# Altium project novena_pvt2.PrjPcb (part 1 of 4)
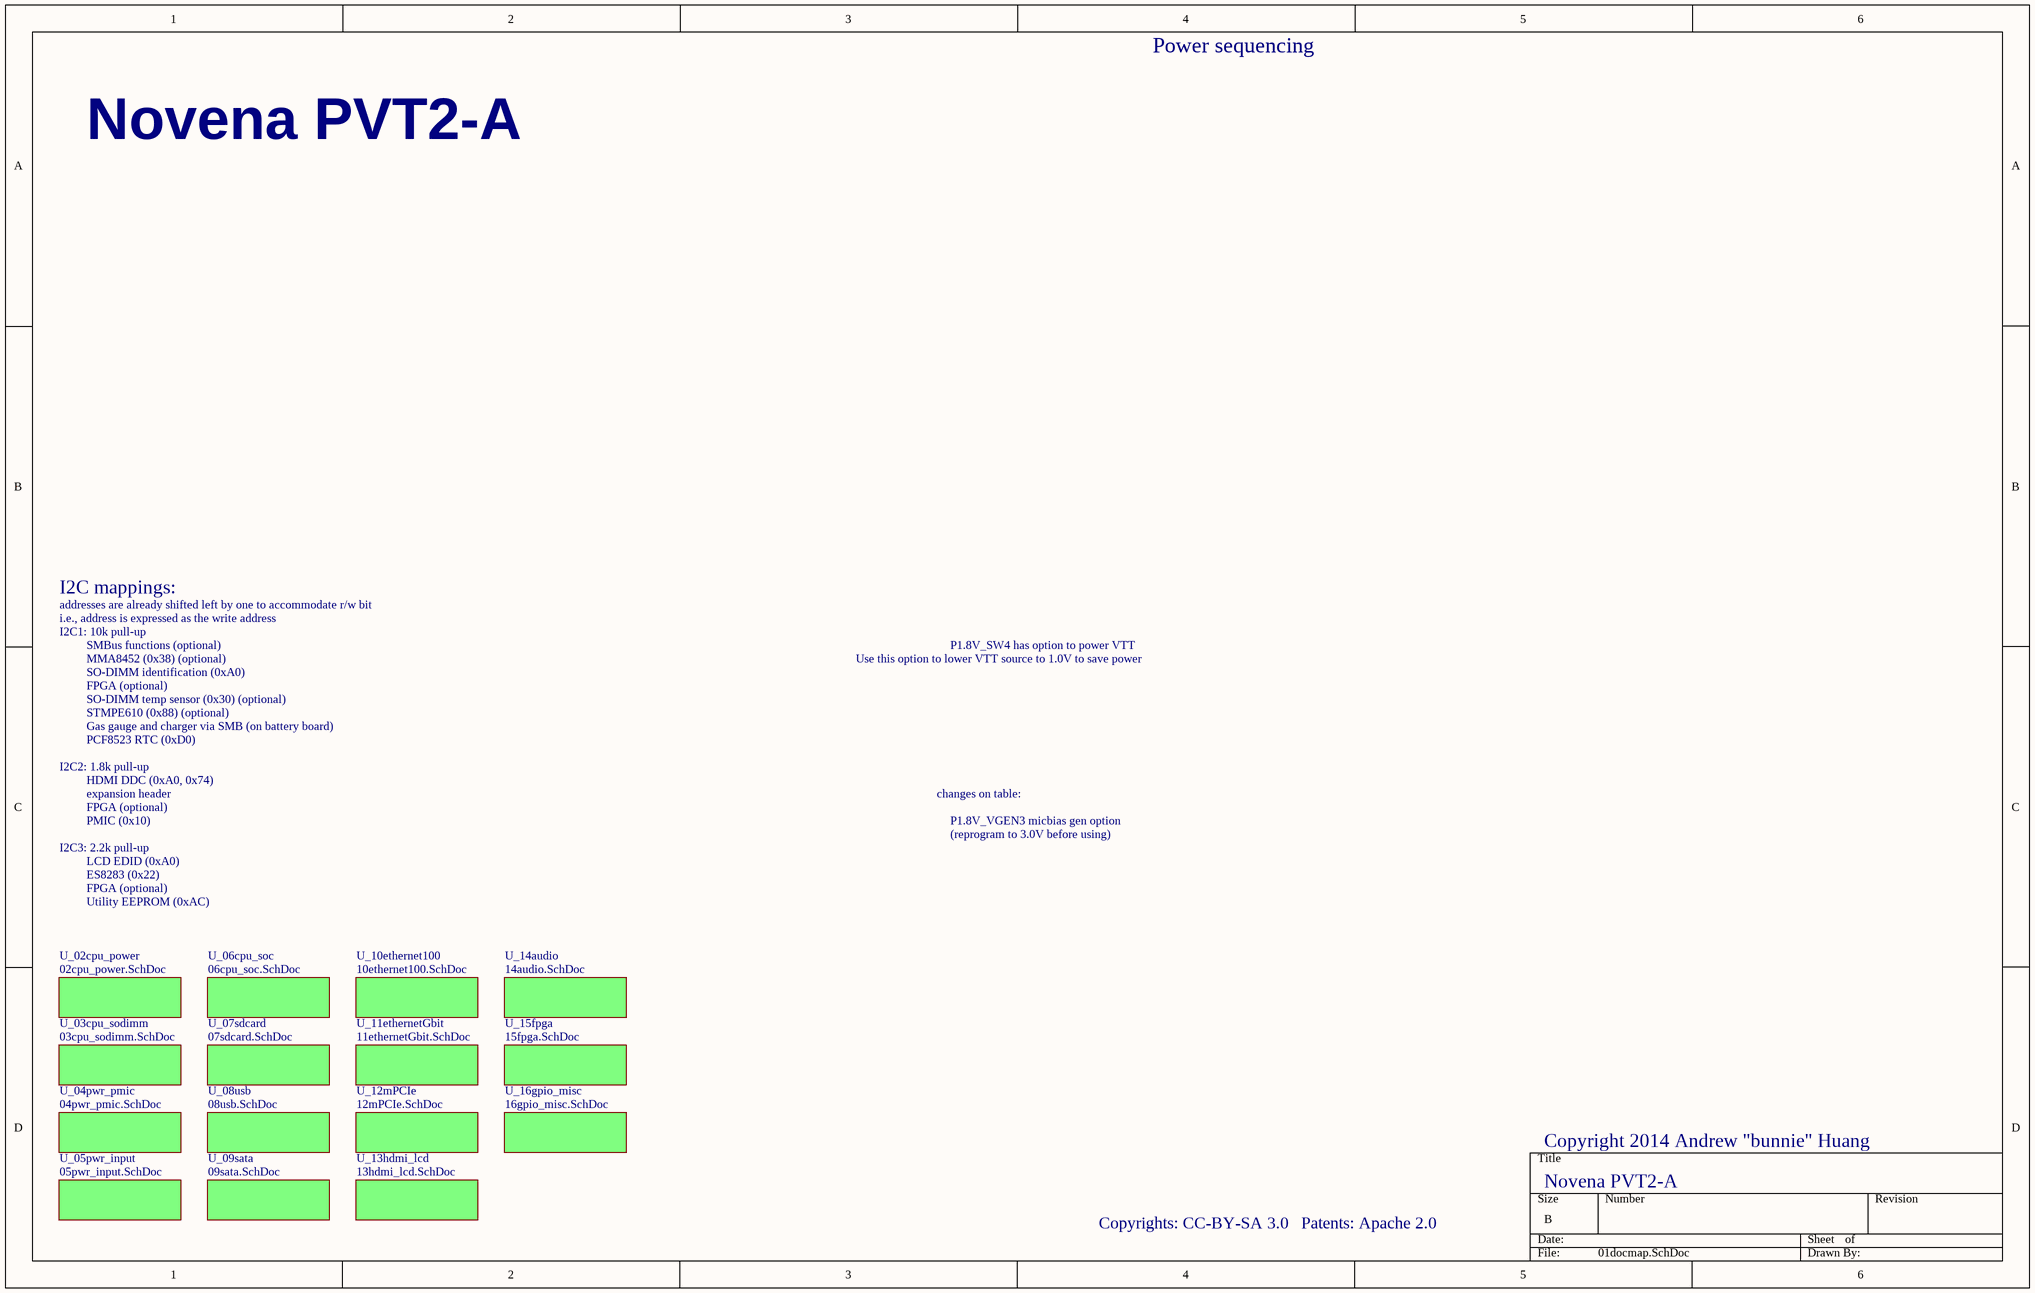
[diagram p0: 01docmap.SchDoc]
16 sheets, 975 parts. Net scope: global (net labels, ports and power ports of the same name join across sheets).
Board file: novena_pvt2_a.PcbDoc
Sheets:
  01docmap.SchDoc
    U_02cpu_power = 02cpu_power.SchDoc
    U_03cpu_sodimm = 03cpu_sodimm.SchDoc
    U_04pwr_pmic = 04pwr_pmic.SchDoc
    U_05pwr_input = 05pwr_input.SchDoc
    U_06cpu_soc = 06cpu_soc.SchDoc
    U_07sdcard = 07sdcard.SchDoc
    U_08usb = 08usb.SchDoc
    U_09sata = 09sata.SchDoc
    U_10ethernet100 = 10ethernet100.SchDoc
    U_11ethernetGbit = 11ethernetGbit.SchDoc
    U_12mPCIe = 12mPCIe.SchDoc
    U_13hdmi_lcd = 13hdmi_lcd.SchDoc
    U_14audio = 14audio.SchDoc
    U_15fpga = 15fpga.SchDoc
    U_16gpio_misc = 16gpio_misc.SchDoc

## Sheet 01docmap.SchDoc
size B

### Sub-sheets
U_02cpu_power = 02cpu_power.SchDoc: no entries
U_03cpu_sodimm = 03cpu_sodimm.SchDoc: no entries
U_04pwr_pmic = 04pwr_pmic.SchDoc: no entries
U_05pwr_input = 05pwr_input.SchDoc: no entries
U_06cpu_soc = 06cpu_soc.SchDoc: no entries
U_07sdcard = 07sdcard.SchDoc: no entries
U_08usb = 08usb.SchDoc: no entries
U_09sata = 09sata.SchDoc: no entries
U_10ethernet100 = 10ethernet100.SchDoc: no entries
U_11ethernetGbit = 11ethernetGbit.SchDoc: no entries
U_12mPCIe = 12mPCIe.SchDoc: no entries
U_13hdmi_lcd = 13hdmi_lcd.SchDoc: no entries
U_14audio = 14audio.SchDoc: no entries
U_15fpga = 15fpga.SchDoc: no entries
U_16gpio_misc = 16gpio_misc.SchDoc: no entries

### Notes on the sheet
- Power sequencing
- Novena PVT2-A
- I2C mappings:
- I2C1: 10k pull-up
- addresses are already shifted left by one to accommodate r/w bit
- i.e., address is expressed as the write address
- SMBus functions (optional)
- MMA8452 (0x38) (optional)
- SO-DIMM identification (0xA0)
- FPGA (optional)
- SO-DIMM temp sensor (0x30) (optional)
- Use this option to lower VTT source to 1.0V to save power
- P1.8V_SW4 has option to power VTT
- I2C2: 1.8k pull-up
- STMPE610 (0x88) (optional)
- Gas gauge and charger via SMB (on battery board)
- PCF8523 RTC (0xD0)
- HDMI DDC (0xA0, 0x74)
- expansion header
- PMIC (0x10)
- changes on table:
- P1.8V_VGEN3 micbias gen option
- (reprogram to 3.0V before using)
- I2C3: 2.2k pull-up
- LCD EDID (0xA0)
- ES8283 (0x22)
- Utility EEPROM (0xAC)
- Copyright 2014 Andrew "bunnie" Huang
- Copyrights: CC-BY-SA 3.0
- Patents: Apache 2.0

## Sheet 02cpu_power.SchDoc
size C
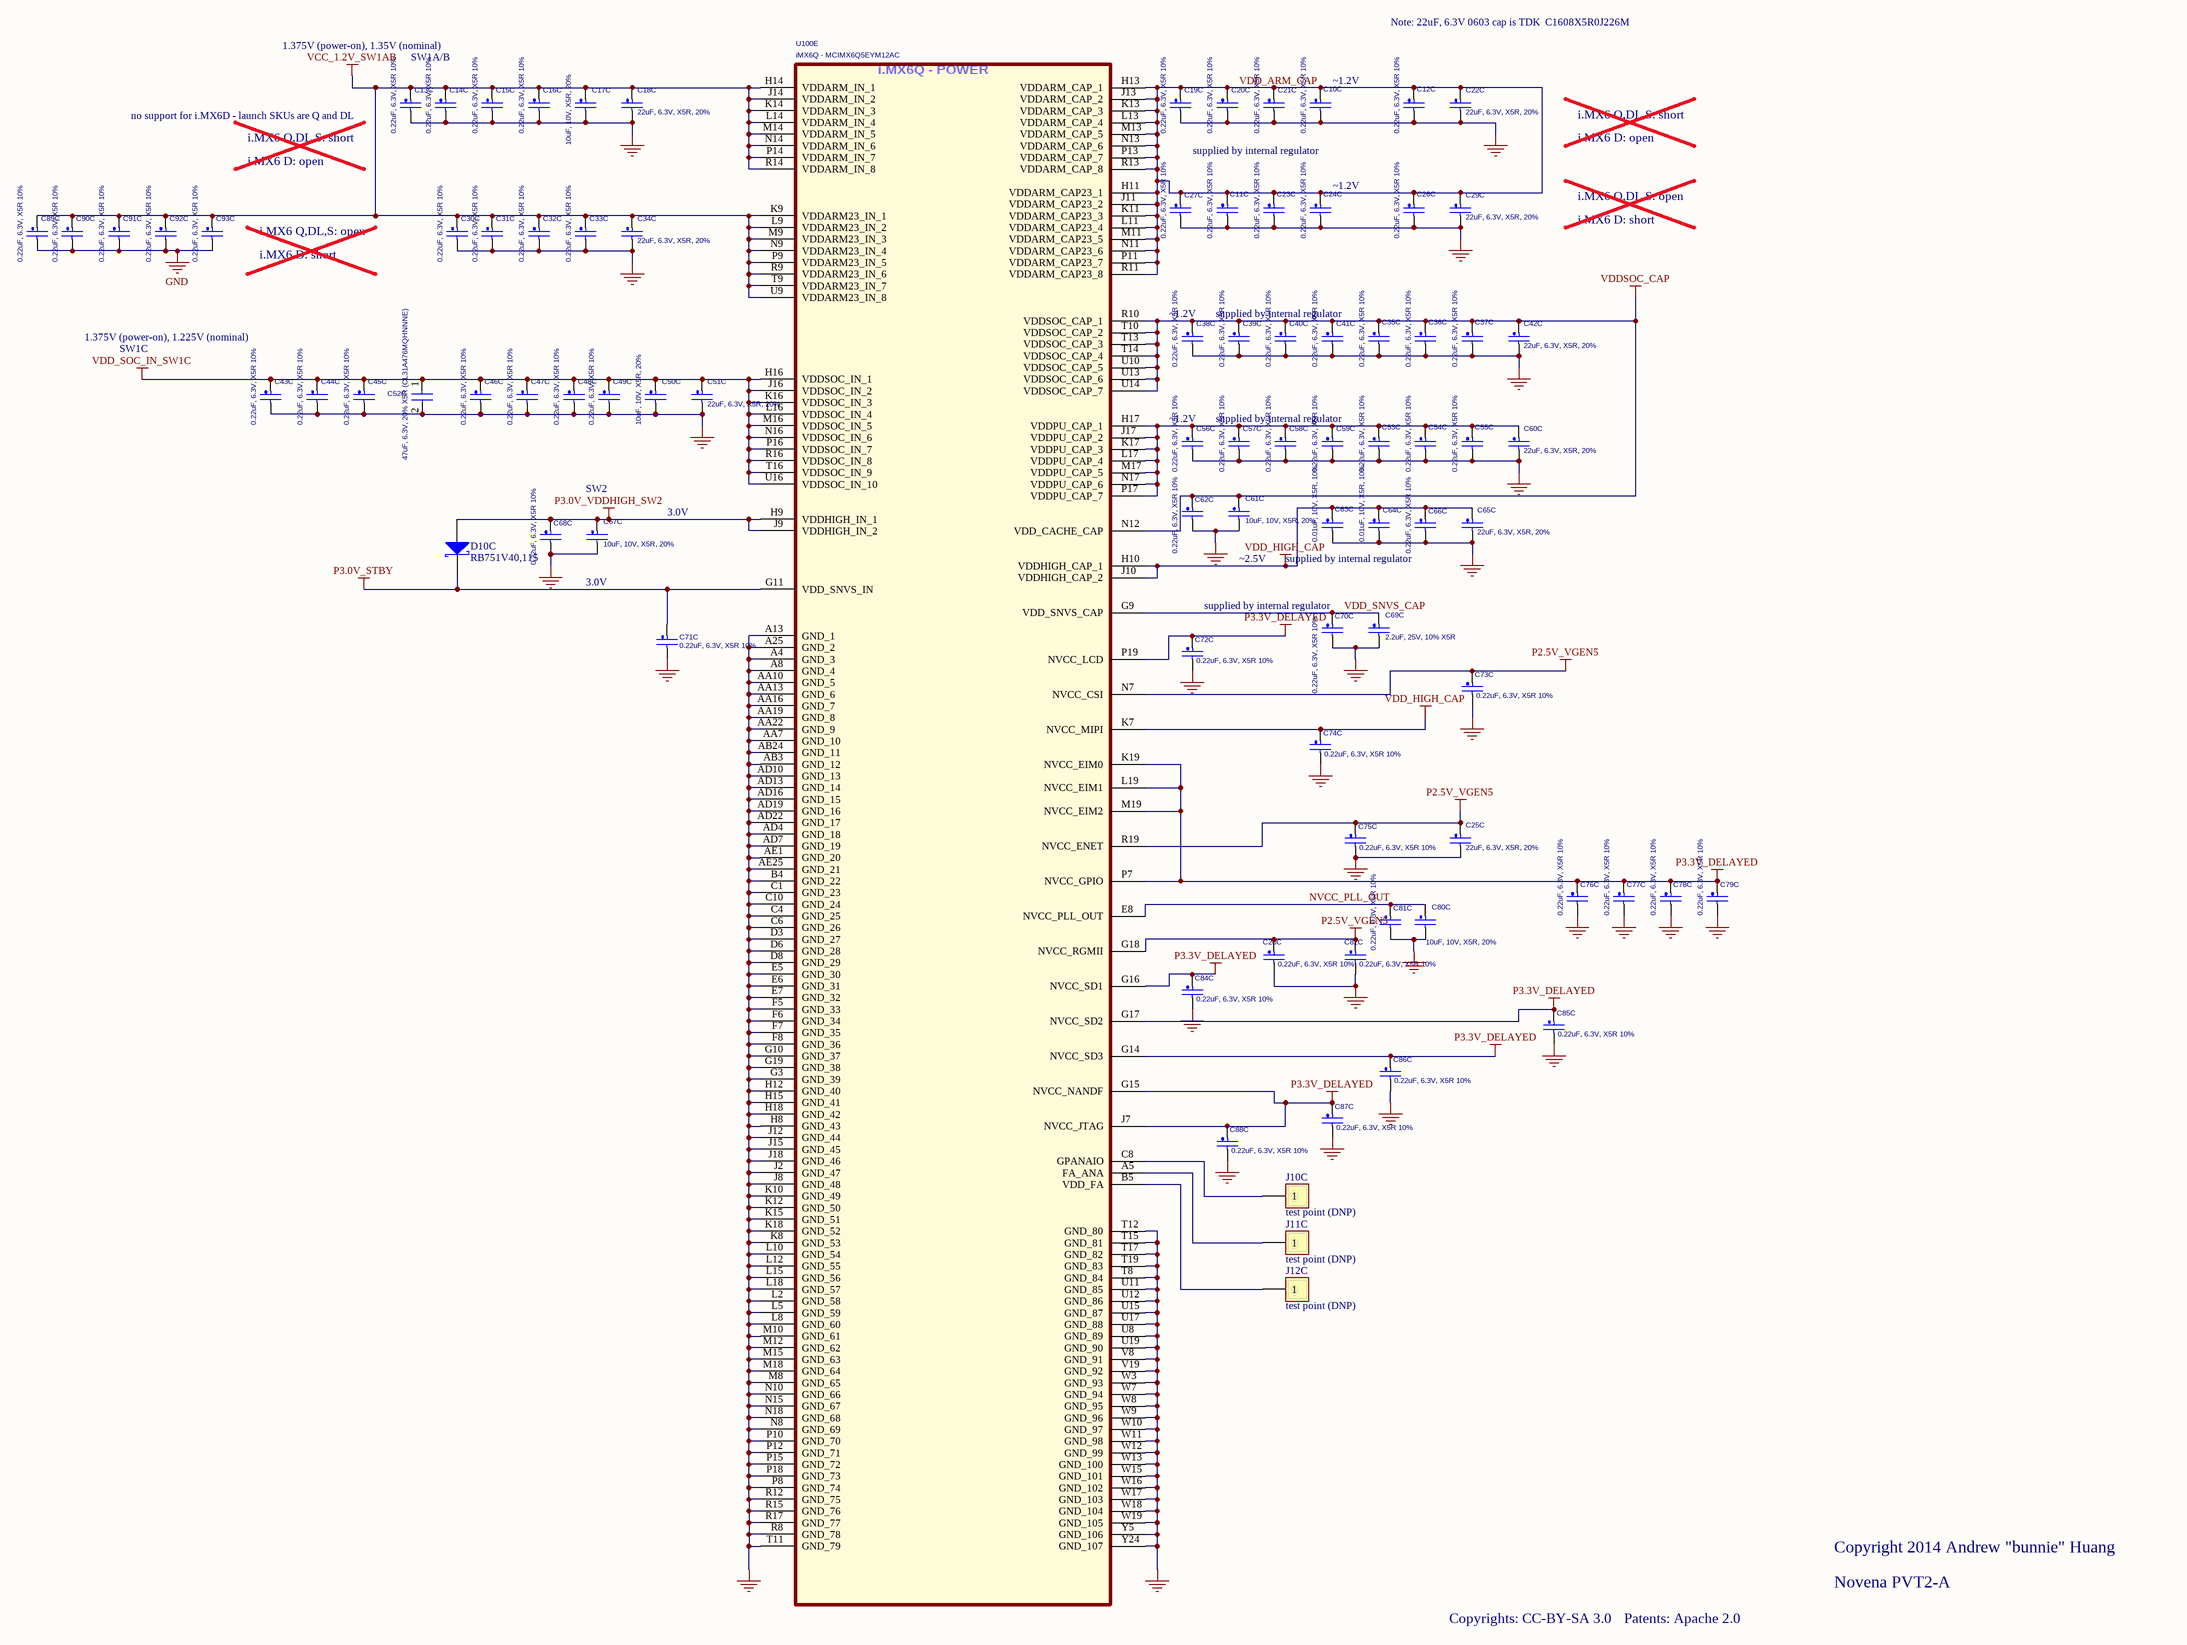
[diagram p1: 02cpu_power.SchDoc]

### Parts
C10C  0.22uF, 6.3V, X5R 10%  [CAPC0603N_B]
C11C  0.22uF, 6.3V, X5R 10%  [CAPC0603N_B]
C12C  0.22uF, 6.3V, X5R 10%  [CAPC0603N_B]
C13C  0.22uF, 6.3V, X5R 10%  [CAPC0603N_B]
C14C  0.22uF, 6.3V, X5R 10%  [CAPC0603N_B]
C15C  0.22uF, 6.3V, X5R 10%  [CAPC0603N_B]
C16C  0.22uF, 6.3V, X5R 10%  [CAPC0603N_B]
C17C  10uF, 10V, X5R, 20%  [CAPC1608N_HD]
C18C  22uF, 6.3V, X5R, 20%  [CAPC1608N_HD]
C19C  0.22uF, 6.3V, X5R 10%  [CAPC0603N_B]
C20C  0.22uF, 6.3V, X5R 10%  [CAPC0603N_B]
C21C  0.22uF, 6.3V, X5R 10%  [CAPC0603N_B]
C22C  22uF, 6.3V, X5R, 20%  [CAPC1608N_HD]
C23C  0.22uF, 6.3V, X5R 10%  [CAPC0603N_B]
C24C  0.22uF, 6.3V, X5R 10%  [CAPC0603N_B]
C25C  22uF, 6.3V, X5R, 20%  [CAPC1608N_HD]
C26C  0.22uF, 6.3V, X5R 10%  [CAPC0603N_B]
C27C  0.22uF, 6.3V, X5R 10%  [CAPC0603N_B]
C28C  0.22uF, 6.3V, X5R 10%  [CAPC0603N_B]
C29C  22uF, 6.3V, X5R, 20%  [CAPC1608N_HD]
C30C  0.22uF, 6.3V, X5R 10%  [CAPC0603N_B]
C31C  0.22uF, 6.3V, X5R 10%  [CAPC0603N_B]
C32C  0.22uF, 6.3V, X5R 10%  [CAPC0603N_B]
C33C  0.22uF, 6.3V, X5R 10%  [CAPC0603N_B]
C34C  22uF, 6.3V, X5R, 20%  [CAPC1608N_HD]
C35C  0.22uF, 6.3V, X5R 10%  [CAPC0603N_B]
C36C  0.22uF, 6.3V, X5R 10%  [CAPC0603N_B]
C37C  0.22uF, 6.3V, X5R 10%  [CAPC0603N_B]
C38C  0.22uF, 6.3V, X5R 10%  [CAPC0603N_B]
C39C  0.22uF, 6.3V, X5R 10%  [CAPC0603N_B]
C40C  0.22uF, 6.3V, X5R 10%  [CAPC0603N_B]
C41C  0.22uF, 6.3V, X5R 10%  [CAPC0603N_B]
C42C  22uF, 6.3V, X5R, 20%  [CAPC1608N_HD]
C43C  0.22uF, 6.3V, X5R 10%  [CAPC0603N_B]
C44C  0.22uF, 6.3V, X5R 10%  [CAPC0603N_B]
C45C  0.22uF, 6.3V, X5R 10%  [CAPC0603N_B]
C46C  0.22uF, 6.3V, X5R 10%  [CAPC0603N_B]
C47C  0.22uF, 6.3V, X5R 10%  [CAPC0603N_B]
C48C  0.22uF, 6.3V, X5R 10%  [CAPC0603N_B]
C49C  0.22uF, 6.3V, X5R 10%  [CAPC0603N_B]
C50C  10uF, 10V, X5R, 20%  [CAPC1608N_HD]
C51C  22uF, 6.3V, X5R, 20%  [CAPC1608N_HD]
C52C  47uF, 6.3V, 20% X5R (CL31A476MQHNNNE)  [CAPC3216N]
C53C  0.22uF, 6.3V, X5R 10%  [CAPC0603N_B]
C54C  0.22uF, 6.3V, X5R 10%  [CAPC0603N_B]
C55C  0.22uF, 6.3V, X5R 10%  [CAPC0603N_B]
C56C  0.22uF, 6.3V, X5R 10%  [CAPC0603N_B]
C57C  0.22uF, 6.3V, X5R 10%  [CAPC0603N_B]
C58C  0.22uF, 6.3V, X5R 10%  [CAPC0603N_B]
C59C  0.22uF, 6.3V, X5R 10%  [CAPC0603N_B]
C60C  22uF, 6.3V, X5R, 20%  [CAPC1608N_HD]
C61C  10uF, 10V, X5R, 20%  [CAPC1608N_HD]
C62C  0.22uF, 6.3V, X5R 10%  [CAPC0603N_B]
C63C  0.01uF, 10V, X5R, 10%  [CAPC0603N_B]
C64C  0.01uF, 10V, X5R, 10%  [CAPC0603N_B]
C65C  22uF, 6.3V, X5R, 20%  [CAPC1608N_HD]
C66C  0.22uF, 6.3V, X5R 10%  [CAPC0603N_B]
C67C  10uF, 10V, X5R, 20%  [CAPC1608N_HD]
C68C  0.22uF, 6.3V, X5R 10%  [CAPC0603N_B]
C69C  2.2uF, 25V, 10% X5R  [CAPC1608N_HD]
C70C  0.22uF, 6.3V, X5R 10%  [CAPC0603N_B]
C71C  0.22uF, 6.3V, X5R 10%  [CAPC0603N_B]
C72C  0.22uF, 6.3V, X5R 10%  [CAPC0603N_B]
C73C  0.22uF, 6.3V, X5R 10%  [CAPC0603N_B]
C74C  0.22uF, 6.3V, X5R 10%  [CAPC0603N_B]
C75C  0.22uF, 6.3V, X5R 10%  [CAPC0603N_B]
C76C  0.22uF, 6.3V, X5R 10%  [CAPC0603N_B]
C77C  0.22uF, 6.3V, X5R 10%  [CAPC0603N_B]
C78C  0.22uF, 6.3V, X5R 10%  [CAPC0603N_B]
C79C  0.22uF, 6.3V, X5R 10%  [CAPC0603N_B]
C80C  10uF, 10V, X5R, 20%  [CAPC1608N_HD]
C81C  0.22uF, 6.3V, X5R 10%  [CAPC0603N_B]
C82C  0.22uF, 6.3V, X5R 10%  [CAPC0603N_B]
C84C  0.22uF, 6.3V, X5R 10%  [CAPC0603N_B]
C85C  0.22uF, 6.3V, X5R 10%  [CAPC0603N_B]
C86C  0.22uF, 6.3V, X5R 10%  [CAPC0603N_B]
C87C  0.22uF, 6.3V, X5R 10%  [CAPC0603N_B]
C88C  0.22uF, 6.3V, X5R 10%  [CAPC0603N_B]
C89C  0.22uF, 6.3V, X5R 10%  [CAPC0603N_B]
C90C  0.22uF, 6.3V, X5R 10%  [CAPC0603N_B]
C91C  0.22uF, 6.3V, X5R 10%  [CAPC0603N_B]
C92C  0.22uF, 6.3V, X5R 10%  [CAPC0603N_B]
C93C  0.22uF, 6.3V, X5R 10%  [CAPC0603N_B]
D10C  RB751V40,115  [SOD-323]
J10C  test point (DNP)  [TP_SMT_38mil]
J11C  test point (DNP)  [TP_SMT_38mil]
J12C  test point (DNP)  [TP_SMT_38mil]
U100  iMX6Q - MCIMX6Q5EYM12AC  [FREESCALE_BGA624C80P25X25_2100X2100X216]  (part E of 12)

### Nets
GND: C10C.2 C11C.2 C12C.2 C13C.2 C14C.2 C15C.2 C16C.2 C17C.2 C18C.2 C19C.2 C20C.2 C21C.2 C22C.2 C23C.2 C24C.2 C25C.2 C26C.2 C27C.2 C28C.2 C29C.2 C30C.2 C31C.2 C32C.2 C33C.2 C34C.2 C35C.2 C36C.2 C37C.2 C38C.2 C39C.2 C40C.2 C41C.2 C42C.2 C43C.2 C44C.2 C45C.2 C46C.2 C47C.2 C48C.2 C49C.2 C50C.2 C51C.2 C52C.2 C53C.2 C54C.2 C55C.2 C56C.2 C57C.2 C58C.2 C59C.2 C60C.2 C61C.2 C62C.2 C63C.2 C64C.2 C65C.2 C66C.2 C67C.2 C68C.2 C69C.2 C70C.2 C71C.2 C72C.2 C73C.2 C74C.2 C75C.2 C76C.2 C77C.2 C78C.2 C79C.2 C80C.2 C81C.2 C82C.2 C84C.2 C85C.2 C86C.2 C87C.2 C88C.2 C89C.2 C90C.2 C91C.2 C92C.2 C93C.2 U100.A4(GND_3) U100.A8(GND_4) U100.A13(GND_1) U100.A25(GND_2) U100.AA7(GND_10) U100.AA10(GND_5) U100.AA13(GND_6) U100.AA16(GND_7) U100.AA19(GND_8) U100.AA22(GND_9) U100.AB3(GND_12) U100.AB24(GND_11) U100.AD4(GND_18) U100.AD7(GND_19) U100.AD10(GND_13) U100.AD13(GND_14) U100.AD16(GND_15) U100.AD19(GND_16) U100.AD22(GND_17) U100.AE1(GND_20) U100.AE25(GND_21) U100.B4(GND_22) U100.C1(GND_23) U100.C4(GND_25) U100.C6(GND_26) U100.C10(GND_24) U100.D3(GND_27) U100.D6(GND_28) U100.D8(GND_29) U100.E5(GND_30) U100.E6(GND_31) U100.E7(GND_32) U100.F5(GND_33) U100.F6(GND_34) U100.F7(GND_35) U100.F8(GND_36) U100.G3(GND_39) U100.G10(GND_37) U100.G19(GND_38) U100.H8(GND_43) U100.H12(GND_40) U100.H15(GND_41) U100.H18(GND_42) U100.J2(GND_47) U100.J8(GND_48) U100.J12(GND_44) U100.J15(GND_45) U100.J18(GND_46) U100.K8(GND_53) U100.K10(GND_49) U100.K12(GND_50) U100.K15(GND_51) U100.K18(GND_52) U100.L2(GND_58) U100.L5(GND_59) U100.L8(GND_60) U100.L10(GND_54) U100.L12(GND_55) U100.L15(GND_56) U100.L18(GND_57) U100.M8(GND_65) U100.M10(GND_61) U100.M12(GND_62) U100.M15(GND_63) U100.M18(GND_64) U100.N8(GND_69) U100.N10(GND_66) U100.N15(GND_67) U100.N18(GND_68) U100.P8(GND_74) U100.P10(GND_70) U100.P12(GND_71) U100.P15(GND_72) U100.P18(GND_73) U100.R8(GND_78) U100.R12(GND_75) U100.R15(GND_76) U100.R17(GND_77) U100.T8(GND_84) U100.T11(GND_79) U100.T12(GND_80) U100.T15(GND_81) U100.T17(GND_82) U100.T19(GND_83) U100.U8(GND_89) U100.U11(GND_85) U100.U12(GND_86) U100.U15(GND_87) U100.U17(GND_88) U100.U19(GND_90) U100.V8(GND_91) U100.V19(GND_92) U100.W3(GND_93) U100.W7(GND_94) U100.W8(GND_95) U100.W9(GND_96) U100.W10(GND_97) U100.W11(GND_98) U100.W12(GND_99) U100.W13(GND_100) U100.W15(GND_101) U100.W16(GND_102) U100.W17(GND_103) U100.W18(GND_104) U100.W19(GND_105) U100.Y5(GND_106) U100.Y24(GND_107)
P2.5V_VGEN5: C25C.1 C28C.1 C73C.1 C75C.1 C82C.1 U100.G18(NVCC_RGMII) U100.N7(NVCC_CSI) U100.R19(NVCC_ENET)
P3.0V_STBY: C71C.1 D10C.2(K) U100.G11(VDD_SNVS_IN)
P3.0V_VDDHIGH_SW2: C67C.1 C68C.1 D10C.1(A) U100.H9(VDDHIGH_IN_1) U100.J9(VDDHIGH_IN_2)
P3.3V_DELAYED: C72C.1 C76C.1 C77C.1 C78C.1 C79C.1 C84C.1 C85C.1 C86C.1 C87C.1 C88C.1 U100.G14(NVCC_SD3) U100.G15(NVCC_NANDF) U100.G16(NVCC_SD1) U100.G17(NVCC_SD2) U100.J7(NVCC_JTAG) U100.K19(NVCC_EIM0) U100.L19(NVCC_EIM1) U100.M19(NVCC_EIM2) U100.P7(NVCC_GPIO) U100.P19(NVCC_LCD)
VCC_1.2V_SW1AB: C13C.1 C14C.1 C15C.1 C16C.1 C17C.1 C18C.1 C30C.1 C31C.1 C32C.1 C33C.1 C34C.1 C89C.1 C90C.1 C91C.1 C92C.1 C93C.1 U100.H14(VDDARM_IN_1) U100.J14(VDDARM_IN_2) U100.K9(VDDARM23_IN_1) U100.K14(VDDARM_IN_3) U100.L9(VDDARM23_IN_2) U100.L14(VDDARM_IN_4) U100.M9(VDDARM23_IN_3) U100.M14(VDDARM_IN_5) U100.N9(VDDARM23_IN_4) U100.N14(VDDARM_IN_6) U100.P9(VDDARM23_IN_5) U100.P14(VDDARM_IN_7) U100.R9(VDDARM23_IN_6) U100.R14(VDDARM_IN_8) U100.T9(VDDARM23_IN_7) U100.U9(VDDARM23_IN_8)
VDD_HIGH_CAP: C63C.1 C64C.1 C65C.1 C66C.1 C74C.1 U100.H10(VDDHIGH_CAP_1) U100.J10(VDDHIGH_CAP_2) U100.K7(NVCC_MIPI)
VDD_SOC_IN_SW1C: C43C.1 C44C.1 C45C.1 C46C.1 C47C.1 C48C.1 C49C.1 C50C.1 C51C.1 C52C.1 U100.H16(VDDSOC_IN_1) U100.J16(VDDSOC_IN_2) U100.K16(VDDSOC_IN_3) U100.L16(VDDSOC_IN_4) U100.M16(VDDSOC_IN_5) U100.N16(VDDSOC_IN_6) U100.P16(VDDSOC_IN_7) U100.R16(VDDSOC_IN_8) U100.T16(VDDSOC_IN_9) U100.U16(VDDSOC_IN_10)
VDDSOC_CAP: C35C.1 C36C.1 C37C.1 C38C.1 C39C.1 C40C.1 C41C.1 C42C.1 C61C.1 C62C.1 U100.N12(VDD_CACHE_CAP) U100.R10(VDDSOC_CAP_1) U100.T10(VDDSOC_CAP_2) U100.T13(VDDSOC_CAP_3) U100.T14(VDDSOC_CAP_4) U100.U10(VDDSOC_CAP_5) U100.U13(VDDSOC_CAP_6) U100.U14(VDDSOC_CAP_7)
NVCC_PLL_OUT: C80C.1 C81C.1 U100.E8(NVCC_PLL_OUT)
VDD_ARM_CAP: C10C.1 C11C.1 C12C.1 C19C.1 C20C.1 C21C.1 C22C.1 C23C.1 C24C.1 C26C.1 C27C.1 C29C.1 U100.H11(VDDARM_CAP23_1) U100.H13(VDDARM_CAP_1) U100.J11(VDDARM_CAP23_2) U100.J13(VDDARM_CAP_2) U100.K11(VDDARM_CAP23_3) U100.K13(VDDARM_CAP_3) U100.L11(VDDARM_CAP23_4) U100.L13(VDDARM_CAP_4) U100.M11(VDDARM_CAP23_5) U100.M13(VDDARM_CAP_5) U100.N11(VDDARM_CAP23_6) U100.N13(VDDARM_CAP_6) U100.P11(VDDARM_CAP23_7) U100.P13(VDDARM_CAP_7) U100.R11(VDDARM_CAP23_8) U100.R13(VDDARM_CAP_8)
VDD_SNVS_CAP: C69C.1 C70C.1 U100.G9(VDD_SNVS_CAP)
NetC53C_1: C53C.1 C54C.1 C55C.1 C56C.1 C57C.1 C58C.1 C59C.1 C60C.1 U100.H17(VDDPU_CAP_1) U100.J17(VDDPU_CAP_2) U100.K17(VDDPU_CAP_3) U100.L17(VDDPU_CAP_4) U100.M17(VDDPU_CAP_5) U100.N17(VDDPU_CAP_6) U100.P17(VDDPU_CAP_7)
NetJ10C_1: J10C.1 U100.C8(GPANAIO)
NetJ11C_1: J11C.1 U100.A5(FA_ANA)
NetJ12C_1: J12C.1 U100.B5(VDD_FA)

### Notes on the sheet
- 1.375V (power-on), 1.35V (nominal)
- SW1A/B
- Note: 22uF, 6.3V 0603 cap is TDK  C1608X5R0J226M
- (near C13C) no support for i.MX6D - launch SKUs are Q and DL
- (near C10C) ~1.2V
- i.MX6 Q,DL,S: short
- i.MX6 D: open
- supplied by internal regulator
- (near C24C) ~1.2V
- i.MX6 Q,DL,S: open
- i.MX6 D: short
- 1.375V (power-on), 1.225V (nominal)
- SW1C
- (near C38C) ~1.2V
- (near C56C) ~1.2V
- SW2
- 3.0V
- (near C61C) ~2.5V
- (near C70C) supplied by internal regulator
- Copyright 2014 Andrew "bunnie" Huang
- Novena PVT2-A
- Copyrights: CC-BY-SA 3.0
- Patents: Apache 2.0
- (in symbol PCIMX6Q6VV1A, part E) i.MX6Q - POWER

### Library data of the parts
C10C C11C = CAP_NP_Dup1: CAP CER 0.22UF 6.3V 20% X5R 0201; CLASS: DISCRETE; PRIORITY_PN: 021-00273; FPLIST: CC0201,CC0201_HD,0201_CC,cc_0201_cir; CAD_APPROVED: YES; MFG_PN01: GRM033R70J103KA01D; MFG_NAME01: MURATA; AGILE_PN: 150-75465; ROOM: CPU; HEIGHT: 0.33 MM; ROHS: Yes; Tolerance: 10%
C12C C26C C35C C54C C55C = CAP_NP_Dup1: CAP CER 0.22UF 6.3V 20% X5R 0201; CLASS: DISCRETE; ROOM: CPU; PRIORITY_PN: 021-00273; FPLIST: CC0201,CC0201_HD,0201_CC,cc_0201_cir; CAD_APPROVED: YES; MFG_PN01: GRM033R70J103KA01D; MFG_NAME01: MURATA; AGILE_PN: 150-75465; HEIGHT: 0.33 MM; ROHS: Yes; Tolerance: 10%
C13C C14C C15C C16C C19C C20C C21C C27C C28C C47C C48C C62C C66C C72C C82C C84C C85C C86C C88C = CAP_NP_Dup1: CAP CER 0.22UF 6.3V 20% X5R 0201; CLASS: DISCRETE; ROOM: CPU; AGILE_PN: 150-77852; MFG_NAME01: TAIYO YUDEN; MFG_PN01: JMK063BJ224MP-F; CAD_APPROVED: Yes; FPLIST: CC0201,CC0201_HD,0201_CC; PRIORITY_PN: 021-00278; Tolerance: 20%; ROHS: Yes; HEIGHT: 0.33 MM
C17C = CAP_NP_Dup1: CAP CER 10UF 6.3V 10% X5R 0603; CLASS: DISCRETE; PRIORITY_PN: 021-00276; FPLIST: CC0603_OV,CC0603,0603_CC; CAD_APPROVED: Yes; MFG_PN01: GMC10X5R106K6R3NT-LF; MFG_NAME01: CAL-CHIP; AGILE_PN: 150-77832; HEIGHT: 1.0MM; ROHS: Yes; Tolerance: 10%
C18C C22C C25C C29C C34C C42C C51C C60C C65C = CAP_NP_Dup1: 22uF, 10V, X5R, 20%; CLASS: DISCRETE; ROOM: CPU; PRIORITY_PN: 021-00282; FPLIST: CC0805_OV,CC0805,0805_CC; CAD_APPROVED: Yes; MFG_PN01: GRM21BR60J226ME39L; MFG_NAME01: MURATA; AGILE_PN: 150-30121; HEIGHT: 1.45MM; ROHS: Yes; Tolerance: 20%
C23C C30C C31C C32C C33C C43C C44C C45C C46C C68C C70C C71C C73C C74C C75C C76C C77C C78C C79C C81C C87C C89C C90C C91C C92C C93C = CAP_NP_Dup1: CAP CER 0.22UF 6.3V 20% X5R 0201; CLASS: DISCRETE; PRIORITY_PN: 021-00278; FPLIST: CC0201,CC0201_HD,0201_CC; CAD_APPROVED: Yes; MFG_PN01: JMK063BJ224MP-F; MFG_NAME01: TAIYO YUDEN; AGILE_PN: 150-77852; ROOM: CPU; HEIGHT: 0.33 MM; ROHS: Yes; Tolerance: 20%
C24C C36C C37C C53C = CAP_NP_Dup1: CAP CER 0.22UF 6.3V 20% X5R 0201; CLASS: DISCRETE; AGILE_PN: 150-75465; MFG_NAME01: MURATA; MFG_PN01: GRM033R70J103KA01D; CAD_APPROVED: YES; FPLIST: CC0201,CC0201_HD,0201_CC,cc_0201_cir; PRIORITY_PN: 021-00273; ROOM: CPU; Tolerance: 10%; ROHS: Yes; HEIGHT: 0.33 MM
C38C C39C C40C C41C C49C C59C = CAP_NP_Dup1: CAP CER 0.22UF 6.3V 20% X5R 0201; CLASS: DISCRETE; ROOM: CPU; PRIORITY_PN: 021-00278; FPLIST: CC0201,CC0201_HD,0201_CC; CAD_APPROVED: Yes; MFG_PN01: JMK063BJ224MP-F; MFG_NAME01: TAIYO YUDEN; AGILE_PN: 150-77852; HEIGHT: 0.33 MM; ROHS: Yes; Tolerance: 20%
C50C C61C C67C C80C = CAP_NP_Dup1: CAP CER 10UF 6.3V 10% X5R 0603; CLASS: DISCRETE; AGILE_PN: 150-77832; MFG_NAME01: CAL-CHIP; MFG_PN01: GMC10X5R106K6R3NT-LF; CAD_APPROVED: Yes; FPLIST: CC0603_OV,CC0603,0603_CC; PRIORITY_PN: 021-00276; Tolerance: 10%; ROHS: Yes; HEIGHT: 1.0MM
C52C = C
C56C C57C C58C = CAP_NP_Dup1: CAP CER 0.22UF 6.3V 20% X5R 0201; CLASS: DISCRETE; AGILE_PN: 150-77852; MFG_NAME01: TAIYO YUDEN; MFG_PN01: JMK063BJ224MP-F; CAD_APPROVED: Yes; FPLIST: CC0201,CC0201_HD,0201_CC; PRIORITY_PN: 021-00278; ROOM: CPU; Tolerance: 20%; ROHS: Yes; HEIGHT: 0.33 MM
C63C C64C = CAP_NP_Dup1: 0.01uF, 10V, X5R; CLASS: DISCRETE; PRIORITY_PN: 021-00273; FPLIST: CC0201,CC0201_HD,0201_CC,cc_0201_cir; CAD_APPROVED: YES; MFG_PN01: GRM033R70J103KA01D; MFG_NAME01: MURATA; AGILE_PN: 150-75465; ROOM: CPU; HEIGHT: 0.33 MM; ROHS: Yes; Tolerance: 10%
C69C = CAP_NP_Dup1: CAP CER 2.2UF 25V 10% X5R 0603; CLASS: DISCRETE; PRIORITY_PN: 021-00276; FPLIST: CC0603_OV,CC0603,0603_CC; CAD_APPROVED: Yes; MFG_PN01: GMC10X5R106K6R3NT-LF; MFG_NAME01: CAL-CHIP; AGILE_PN: 150-77832; HEIGHT: 1.0MM; ROHS: Yes; Tolerance: 10%
D10C = D Schottky: Schottky Diode; Code - JEDEC: DO-214-AA; Published: 8-Jun-2000; Publisher: Altium Limited; Revision: July-2002: Re-released for DXP Platform.
J10C J11C J12C = CON1: Connector
U100 = PCIMX6Q6VV1A: PCIMX6Q5EVT10AC; AGILE_PN: TMP-WF-14526; MFG_NAME01: Freescale Semiconductor; PRE_APN: 344-01218; MFG_PN01: PCIMX6Q6VV1A; ROHS: Yes; HEIGHT: 2.16MM

## Sheet 03cpu_sodimm.SchDoc
size B portrait
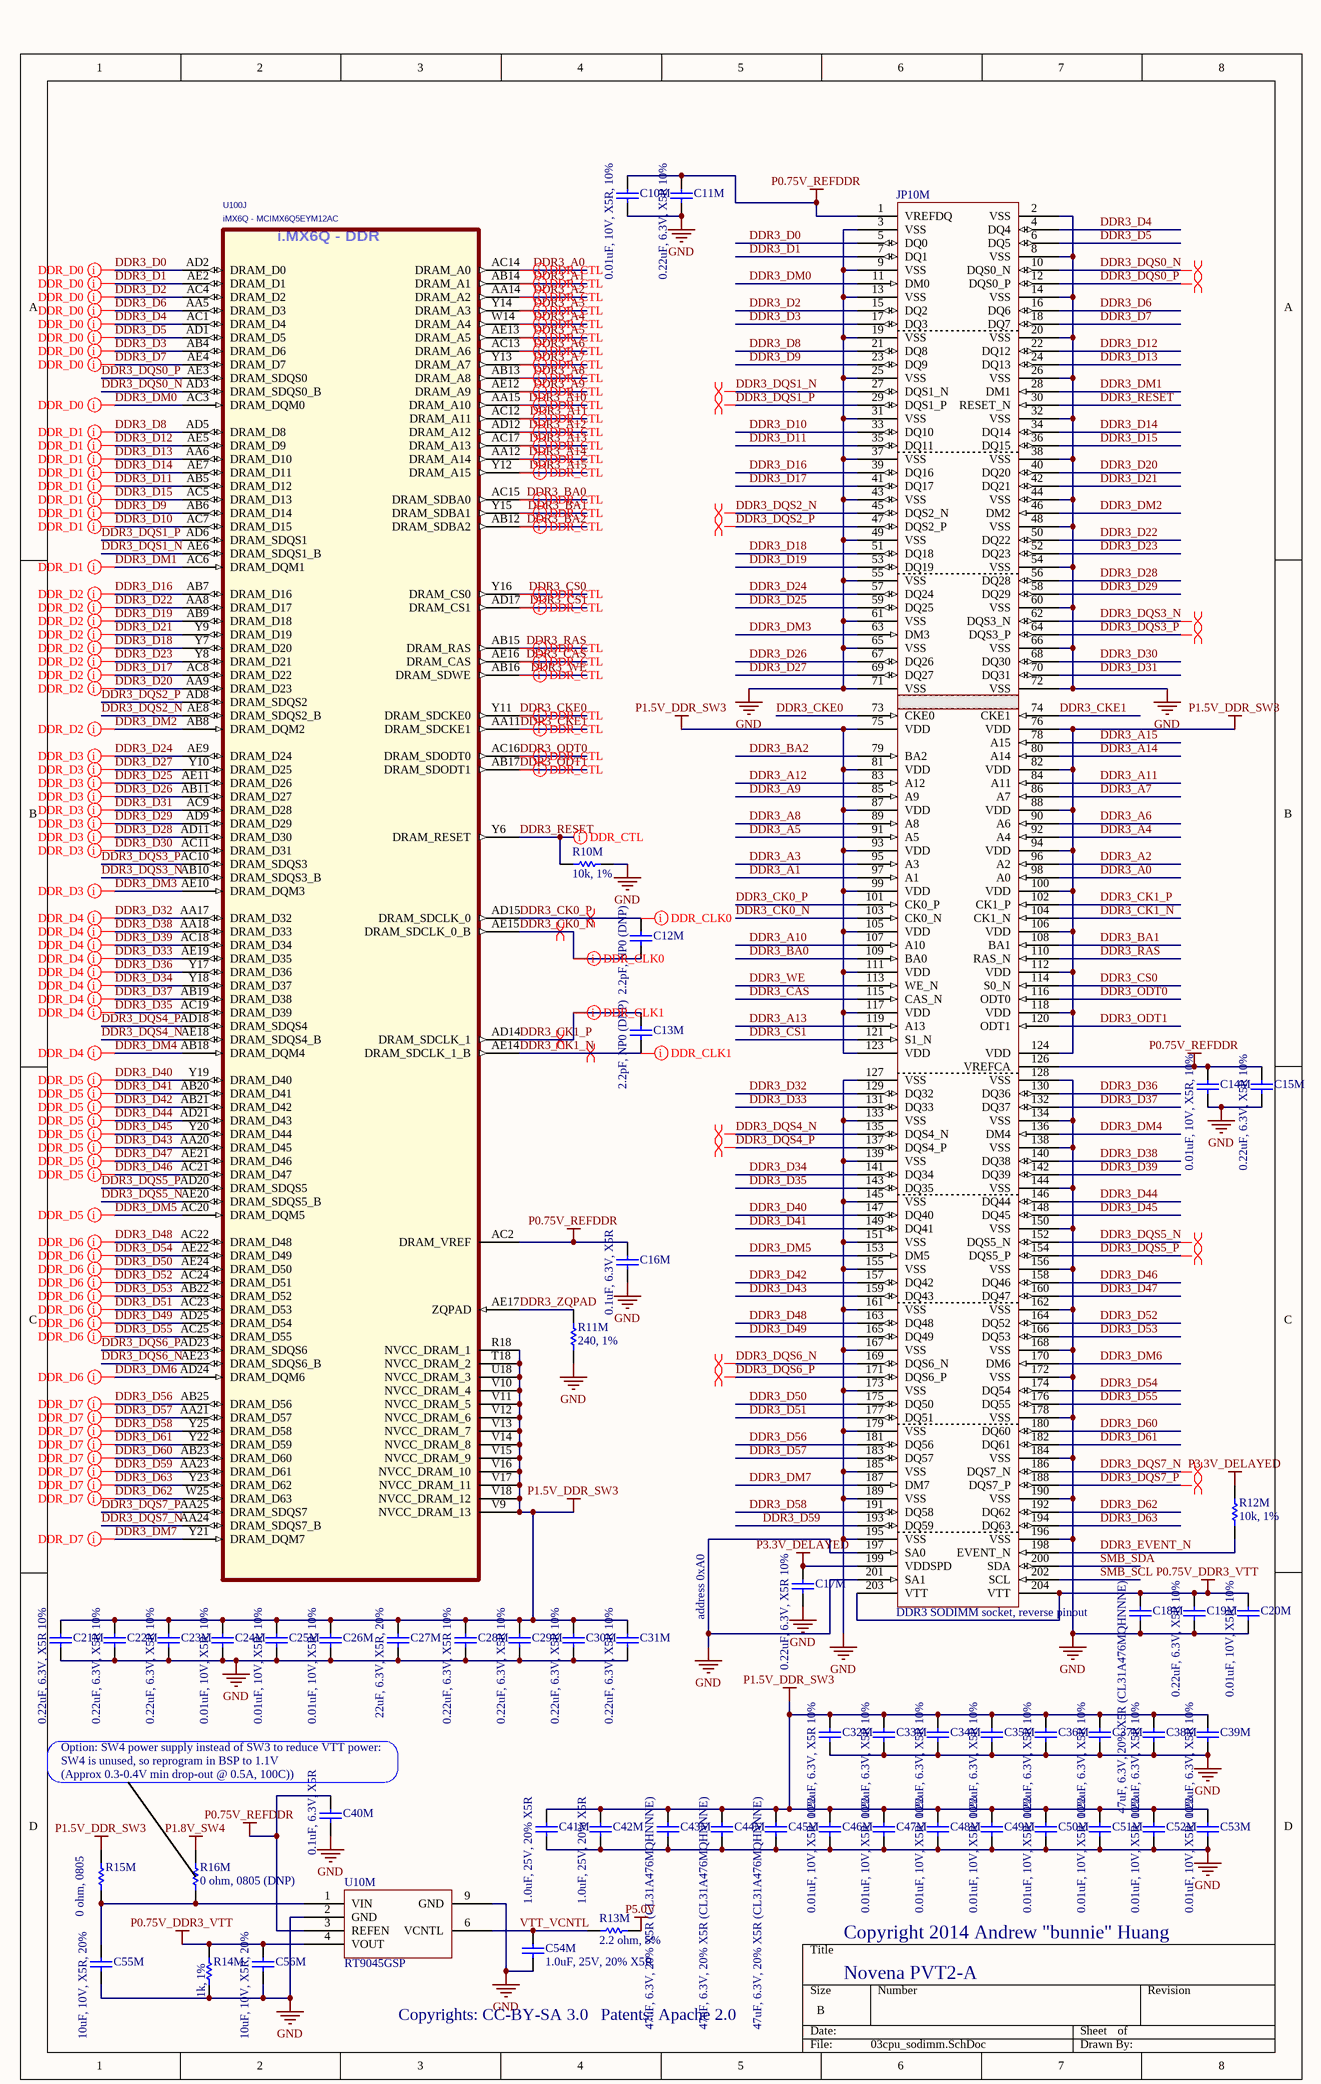
[diagram p2: 03cpu_sodimm.SchDoc]

### Parts
C10M  0.01uF, 10V, X5R, 10%  [CAPC0603N_B]
C11M  0.22uF, 6.3V, X5R 10%  [CAPC0603N_B]
C12M  2.2pF, NP0 (DNP)  [CAPC1005N]
C13M  2.2pF, NP0 (DNP)  [CAPC1005N]
C14M  0.01uF, 10V, X5R, 10%  [CAPC0603N_B]
C15M  0.22uF, 6.3V, X5R 10%  [CAPC0603N_B]
C16M  0.1uF, 6.3V, X5R  [CAPC0603N_B]
C17M  0.22uF, 6.3V, X5R 10%  [CAPC0603N_B]
C18M  47uF, 6.3V, 20% X5R (CL31A476MQHNNNE)  [CAPC3216N]
C19M  0.22uF, 6.3V, X5R 10%  [CAPC0603N_B]
C20M  0.01uF, 10V, X5R, 10%  [CAPC0603N_B]
C21M  0.22uF, 6.3V, X5R 10%  [CAPC0603N_B]
C22M  0.22uF, 6.3V, X5R 10%  [CAPC0603N_B]
C23M  0.22uF, 6.3V, X5R 10%  [CAPC0603N_B]
C24M  0.01uF, 10V, X5R, 10%  [CAPC0603N_B]
C25M  0.01uF, 10V, X5R, 10%  [CAPC0603N_B]
C26M  0.01uF, 10V, X5R, 10%  [CAPC0603N_B]
C27M  22uF, 6.3V, X5R, 20%  [CAPC1608N_HD]
C28M  0.22uF, 6.3V, X5R 10%  [CAPC0603N_B]
C29M  0.22uF, 6.3V, X5R 10%  [CAPC0603N_B]
C30M  0.22uF, 6.3V, X5R 10%  [CAPC0603N_B]
C31M  0.22uF, 6.3V, X5R 10%  [CAPC0603N_B]
C32M  0.22uF, 6.3V, X5R 10%  [CAPC0603N_B]
C33M  0.22uF, 6.3V, X5R 10%  [CAPC0603N_B]
C34M  0.22uF, 6.3V, X5R 10%  [CAPC0603N_B]
C35M  0.22uF, 6.3V, X5R 10%  [CAPC0603N_B]
C36M  0.22uF, 6.3V, X5R 10%  [CAPC0603N_B]
C37M  0.22uF, 6.3V, X5R 10%  [CAPC0603N_B]
C38M  0.22uF, 6.3V, X5R 10%  [CAPC0603N_B]
C39M  0.22uF, 6.3V, X5R 10%  [CAPC0603N_B]
C40M  0.1uF, 6.3V, X5R  [CAPC0603N_B]
C41M  1.0uF, 25V, 20% X5R  [CAPC1608N]
C42M  1.0uF, 25V, 20% X5R  [CAPC1608N]
C43M  47uF, 6.3V, 20% X5R (CL31A476MQHNNNE)  [CAPC3216N]
C44M  47uF, 6.3V, 20% X5R (CL31A476MQHNNNE)  [CAPC3216N]
C45M  47uF, 6.3V, 20% X5R (CL31A476MQHNNNE)  [CAPC3216N]
C46M  0.01uF, 10V, X5R, 10%  [CAPC0603N_B]
C47M  0.01uF, 10V, X5R, 10%  [CAPC0603N_B]
C48M  0.01uF, 10V, X5R, 10%  [CAPC0603N_B]
C49M  0.01uF, 10V, X5R, 10%  [CAPC0603N_B]
C50M  0.01uF, 10V, X5R, 10%  [CAPC0603N_B]
C51M  0.01uF, 10V, X5R, 10%  [CAPC0603N_B]
C52M  0.01uF, 10V, X5R, 10%  [CAPC0603N_B]
C53M  0.01uF, 10V, X5R, 10%  [CAPC0603N_B]
C54M  1.0uF, 25V, 20% X5R  [CAPC1608N]
C55M  10uF, 10V, X5R, 20%  [CAPC1608N]
C56M  10uF, 10V, X5R, 20%  [CAPC1608N]
JP10M  DDR3 SODIMM socket, reverse pinout  [DDR3_SODIMM_REV]
R10M  10k, 1%  [RESC1005N]
R11M  240, 1%  [RESC1005N]
R12M  10k, 1%  [RESC1005N]
R13M  2.2 ohm, 5%  [RESC1005N]
R14M  1k, 1%  [RESC1005N]
R15M  0 ohm, 0805  [RESC2012N]
R16M  0 ohm, 0805 (DNP)  [RESC2012N]
U10M  RT9045GSP  [SOIC127P600_HS-8N]
U100  iMX6Q - MCIMX6Q5EYM12AC  [FREESCALE_BGA624C80P25X25_2100X2100X216]  (part J of 12)

### Nets
GND: C10M.2 C11M.2 C14M.2 C15M.2 C16M.2 C17M.2 C18M.2 C19M.2 C20M.2 C21M.2 C22M.2 C23M.2 C24M.2 C25M.2 C26M.2 C27M.2 C28M.2 C29M.2 C30M.2 C31M.2 C32M.2 C33M.2 C34M.2 C35M.2 C36M.2 C37M.2 C38M.2 C39M.2 C40M.2 C41M.2 C42M.2 C43M.2 C44M.2 C45M.2 C46M.2 C47M.2 C48M.2 C49M.2 C50M.2 C51M.2 C52M.2 C53M.2 C54M.2 C55M.2 C56M.2 JP10M.2(VSS) JP10M.3(VSS) JP10M.8(VSS) JP10M.9(VSS) JP10M.13(VSS) JP10M.14(VSS) JP10M.19(VSS) JP10M.20(VSS) JP10M.25(VSS) JP10M.26(VSS) JP10M.31(VSS) JP10M.32(VSS) JP10M.37(VSS) JP10M.38(VSS) JP10M.43(VSS) JP10M.44(VSS) JP10M.48(VSS) JP10M.49(VSS) JP10M.54(VSS) JP10M.55(VSS) JP10M.60(VSS) JP10M.61(VSS) JP10M.65(VSS) JP10M.66(VSS) JP10M.71(VSS) JP10M.72(VSS) JP10M.127(VSS) JP10M.128(VSS) JP10M.133(VSS) JP10M.134(VSS) JP10M.138(VSS) JP10M.139(VSS) JP10M.144(VSS) JP10M.145(VSS) JP10M.150(VSS) JP10M.151(VSS) JP10M.155(VSS) JP10M.156(VSS) JP10M.161(VSS) JP10M.162(VSS) JP10M.167(VSS) JP10M.168(VSS) JP10M.172(VSS) JP10M.173(VSS) JP10M.178(VSS) JP10M.179(VSS) JP10M.184(VSS) JP10M.185(VSS) JP10M.189(VSS) JP10M.190(VSS) JP10M.195(VSS) JP10M.196(VSS) JP10M.197(SA0) JP10M.201(SA1) R10M.2 R11M.2 R14M.2 U10M.2(GND) U10M.9(GND)
P0.75V_DDR3_VTT: C18M.1 C19M.1 C20M.1 C56M.1 JP10M.203(VTT) JP10M.204(VTT) R14M.1 U10M.4(VOUT)
P0.75V_REFDDR: C10M.1 C11M.1 C14M.1 C15M.1 C16M.1 C40M.1 JP10M.1(VREFDQ) JP10M.126(VREFCA) U10M.3(REFEN) U100.AC2(DRAM_VREF)
P1.5V_DDR_SW3: C21M.1 C22M.1 C23M.1 C24M.1 C25M.1 C26M.1 C27M.1 C28M.1 C29M.1 C30M.1 C31M.1 C32M.1 C33M.1 C34M.1 C35M.1 C36M.1 C37M.1 C38M.1 C39M.1 C41M.1 C42M.1 C43M.1 C44M.1 C45M.1 C46M.1 C47M.1 C48M.1 C49M.1 C50M.1 C51M.1 C52M.1 C53M.1 JP10M.75(VDD) JP10M.76(VDD) JP10M.81(VDD) JP10M.82(VDD) JP10M.87(VDD) JP10M.88(VDD) JP10M.93(VDD) JP10M.94(VDD) JP10M.99(VDD) JP10M.100(VDD) JP10M.105(VDD) JP10M.106(VDD) JP10M.111(VDD) JP10M.112(VDD) JP10M.117(VDD) JP10M.118(VDD) JP10M.123(VDD) JP10M.124(VDD) R15M.1 U100.R18(NVCC_DRAM_1) U100.T18(NVCC_DRAM_2) U100.U18(NVCC_DRAM_3) U100.V9(NVCC_DRAM_13) U100.V10(NVCC_DRAM_4) U100.V11(NVCC_DRAM_5) U100.V12(NVCC_DRAM_6) U100.V13(NVCC_DRAM_7) U100.V14(NVCC_DRAM_8) U100.V15(NVCC_DRAM_9) U100.V16(NVCC_DRAM_10) U100.V17(NVCC_DRAM_11) U100.V18(NVCC_DRAM_12)
P1.8V_SW4: R16M.1
P3.3V_DELAYED: C17M.1 JP10M.199(VDDSPD) R12M.1
P5.0V: R13M.1
DDR3_A0: JP10M.98(A0) U100.AC14(DRAM_A0)
DDR3_A1: JP10M.97(A1) U100.AB14(DRAM_A1)
DDR3_A2: JP10M.96(A2) U100.AA14(DRAM_A2)
DDR3_A3: JP10M.95(A3) U100.Y14(DRAM_A3)
DDR3_A4: JP10M.92(A4) U100.W14(DRAM_A4)
DDR3_A5: JP10M.91(A5) U100.AE13(DRAM_A5)
DDR3_A6: JP10M.90(A6) U100.AC13(DRAM_A6)
DDR3_A7: JP10M.86(A7) U100.Y13(DRAM_A7)
DDR3_A8: JP10M.89(A8) U100.AB13(DRAM_A8)
DDR3_A9: JP10M.85(A9) U100.AE12(DRAM_A9)
DDR3_A10: JP10M.107(A10) U100.AA15(DRAM_A10)
DDR3_A11: JP10M.84(A11) U100.AC12(DRAM_A11)
DDR3_A12: JP10M.83(A12) U100.AD12(DRAM_A12)
DDR3_A13: JP10M.119(A13) U100.AC17(DRAM_A13)
DDR3_A14: JP10M.80(A14) U100.AA12(DRAM_A14)
DDR3_A15: JP10M.78(A15) U100.Y12(DRAM_A15)
DDR3_BA0: JP10M.109(BA0) U100.AC15(DRAM_SDBA0)
DDR3_BA1: JP10M.108(BA1) U100.Y15(DRAM_SDBA1)
DDR3_BA2: JP10M.79(BA2) U100.AB12(DRAM_SDBA2)
DDR3_CAS: JP10M.115(CAS_N) U100.AE16(DRAM_CAS)
DDR3_CK0_N: C12M.2 JP10M.103(CK0_N) U100.AE15(DRAM_SDCLK_0_B)
DDR3_CK0_P: C12M.1 JP10M.101(CK0_P) U100.AD15(DRAM_SDCLK_0)
DDR3_CK1_N: C13M.2 JP10M.104(CK1_N) U100.AE14(DRAM_SDCLK_1_B)
DDR3_CK1_P: C13M.1 JP10M.102(CK1_P) U100.AD14(DRAM_SDCLK_1)
DDR3_CKE0: JP10M.73(CKE0) U100.Y11(DRAM_SDCKE0)
DDR3_CKE1: JP10M.74(CKE1) U100.AA11(DRAM_SDCKE1)
DDR3_CS0: JP10M.114(S0_N) U100.Y16(DRAM_CS0)
DDR3_CS1: JP10M.121(S1_N) U100.AD17(DRAM_CS1)
DDR3_D0: JP10M.5(DQ0) U100.AD2(DRAM_D0)
DDR3_D1: JP10M.7(DQ1) U100.AE2(DRAM_D1)
DDR3_D2: JP10M.15(DQ2) U100.AC4(DRAM_D2)
DDR3_D3: JP10M.17(DQ3) U100.AB4(DRAM_D6)
DDR3_D4: JP10M.4(DQ4) U100.AC1(DRAM_D4)
DDR3_D5: JP10M.6(DQ5) U100.AD1(DRAM_D5)
DDR3_D6: JP10M.16(DQ6) U100.AA5(DRAM_D3)
DDR3_D7: JP10M.18(DQ7) U100.AE4(DRAM_D7)
DDR3_D8: JP10M.21(DQ8) U100.AD5(DRAM_D8)
DDR3_D9: JP10M.23(DQ9) U100.AB6(DRAM_D14)
DDR3_D10: JP10M.33(DQ10) U100.AC7(DRAM_D15)
DDR3_D11: JP10M.35(DQ11) U100.AB5(DRAM_D12)
DDR3_D12: JP10M.22(DQ12) U100.AE5(DRAM_D9)
DDR3_D13: JP10M.24(DQ13) U100.AA6(DRAM_D10)
DDR3_D14: JP10M.34(DQ14) U100.AE7(DRAM_D11)
DDR3_D15: JP10M.36(DQ15) U100.AC5(DRAM_D13)
DDR3_D16: JP10M.39(DQ16) U100.AB7(DRAM_D16)
DDR3_D17: JP10M.41(DQ17) U100.AC8(DRAM_D22)
DDR3_D18: JP10M.51(DQ18) U100.Y7(DRAM_D20)
DDR3_D19: JP10M.53(DQ19) U100.AB9(DRAM_D18)
DDR3_D20: JP10M.40(DQ20) U100.AA9(DRAM_D23)
DDR3_D21: JP10M.42(DQ21) U100.Y9(DRAM_D19)
DDR3_D22: JP10M.50(DQ22) U100.AA8(DRAM_D17)
DDR3_D23: JP10M.52(DQ23) U100.Y8(DRAM_D21)
DDR3_D24: JP10M.57(DQ24) U100.AE9(DRAM_D24)
DDR3_D25: JP10M.59(DQ25) U100.AE11(DRAM_D26)
DDR3_D26: JP10M.67(DQ26) U100.AB11(DRAM_D27)
DDR3_D27: JP10M.69(DQ27) U100.Y10(DRAM_D25)
DDR3_D28: JP10M.56(DQ28) U100.AD11(DRAM_D30)
DDR3_D29: JP10M.58(DQ29) U100.AD9(DRAM_D29)
DDR3_D30: JP10M.68(DQ30) U100.AC11(DRAM_D31)
DDR3_D31: JP10M.70(DQ31) U100.AC9(DRAM_D28)
DDR3_D32: JP10M.129(DQ32) U100.AA17(DRAM_D32)
DDR3_D33: JP10M.131(DQ33) U100.AE19(DRAM_D35)
DDR3_D34: JP10M.141(DQ34) U100.Y18(DRAM_D37)
DDR3_D35: JP10M.143(DQ35) U100.AC19(DRAM_D39)
DDR3_D36: JP10M.130(DQ36) U100.Y17(DRAM_D36)
DDR3_D37: JP10M.132(DQ37) U100.AB19(DRAM_D38)
DDR3_D38: JP10M.140(DQ38) U100.AA18(DRAM_D33)
DDR3_D39: JP10M.142(DQ39) U100.AC18(DRAM_D34)
DDR3_D40: JP10M.147(DQ40) U100.Y19(DRAM_D40)
DDR3_D41: JP10M.149(DQ41) U100.AB20(DRAM_D41)
DDR3_D42: JP10M.157(DQ42) U100.AB21(DRAM_D42)
DDR3_D43: JP10M.159(DQ43) U100.AA20(DRAM_D45)
DDR3_D44: JP10M.146(DQ44) U100.AD21(DRAM_D43)
DDR3_D45: JP10M.148(DQ45) U100.Y20(DRAM_D44)
DDR3_D46: JP10M.158(DQ46) U100.AC21(DRAM_D47)
DDR3_D47: JP10M.160(DQ47) U100.AE21(DRAM_D46)
DDR3_D48: JP10M.163(DQ48) U100.AC22(DRAM_D48)
DDR3_D49: JP10M.165(DQ49) U100.AD25(DRAM_D54)
DDR3_D50: JP10M.175(DQ50) U100.AE24(DRAM_D50)
DDR3_D51: JP10M.177(DQ51) U100.AC23(DRAM_D53)
DDR3_D52: JP10M.164(DQ52) U100.AC24(DRAM_D51)
DDR3_D53: JP10M.166(DQ53) U100.AB22(DRAM_D52)
DDR3_D54: JP10M.174(DQ54) U100.AE22(DRAM_D49)
DDR3_D55: JP10M.176(DQ55) U100.AC25(DRAM_D55)
DDR3_D56: JP10M.181(DQ56) U100.AB25(DRAM_D56)
DDR3_D57: JP10M.183(DQ57) U100.AA21(DRAM_D57)
DDR3_D58: JP10M.191(DQ58) U100.Y25(DRAM_D58)
DDR3_D59: JP10M.193(DQ59) U100.AA23(DRAM_D61)
DDR3_D60: JP10M.180(DQ60) U100.AB23(DRAM_D60)
DDR3_D61: JP10M.182(DQ61) U100.Y22(DRAM_D59)
DDR3_D62: JP10M.192(DQ62) U100.W25(DRAM_D63)
DDR3_D63: JP10M.194(DQ63) U100.Y23(DRAM_D62)
DDR3_DM0: JP10M.11(DM0) U100.AC3(DRAM_DQM0)
DDR3_DM1: JP10M.28(DM1) U100.AC6(DRAM_DQM1)
DDR3_DM2: JP10M.46(DM2) U100.AB8(DRAM_DQM2)
DDR3_DM3: JP10M.63(DM3) U100.AE10(DRAM_DQM3)
DDR3_DM4: JP10M.136(DM4) U100.AB18(DRAM_DQM4)
DDR3_DM5: JP10M.153(DM5) U100.AC20(DRAM_DQM5)
DDR3_DM6: JP10M.170(DM6) U100.AD24(DRAM_DQM6)
DDR3_DM7: JP10M.187(DM7) U100.Y21(DRAM_DQM7)
DDR3_DQS0_N: JP10M.10(DQS0_N) U100.AD3(DRAM_SDQS0_B)
DDR3_DQS0_P: JP10M.12(DQS0_P) U100.AE3(DRAM_SDQS0)
DDR3_DQS1_N: JP10M.27(DQS1_N) U100.AE6(DRAM_SDQS1_B)
DDR3_DQS1_P: JP10M.29(DQS1_P) U100.AD6(DRAM_SDQS1)
DDR3_DQS2_N: JP10M.45(DQS2_N) U100.AE8(DRAM_SDQS2_B)
DDR3_DQS2_P: JP10M.47(DQS2_P) U100.AD8(DRAM_SDQS2)
DDR3_DQS3_N: JP10M.62(DQS3_N) U100.AB10(DRAM_SDQS3_B)
DDR3_DQS3_P: JP10M.64(DQS3_P) U100.AC10(DRAM_SDQS3)
DDR3_DQS4_N: JP10M.135(DQS4_N) U100.AE18(DRAM_SDQS4_B)
DDR3_DQS4_P: JP10M.137(DQS4_P) U100.AD18(DRAM_SDQS4)
DDR3_DQS5_N: JP10M.152(DQS5_N) U100.AE20(DRAM_SDQS5_B)
DDR3_DQS5_P: JP10M.154(DQS5_P) U100.AD20(DRAM_SDQS5)
DDR3_DQS6_N: JP10M.169(DQS6_N) U100.AE23(DRAM_SDQS6_B)
DDR3_DQS6_P: JP10M.171(DQS6_P) U100.AD23(DRAM_SDQS6)
DDR3_DQS7_N: JP10M.186(DQS7_N) U100.AA24(DRAM_SDQS7_B)
DDR3_DQS7_P: JP10M.188(DQS7_P) U100.AA25(DRAM_SDQS7)
DDR3_EVENT_N: JP10M.198(EVENT_N) R12M.2
DDR3_ODT0: JP10M.116(ODT0) U100.AC16(DRAM_SDODT0)
DDR3_ODT1: JP10M.120(ODT1) U100.AB17(DRAM_SDODT1)
DDR3_RAS: JP10M.110(RAS_N) U100.AB15(DRAM_RAS)
DDR3_RESET: JP10M.30(RESET_N) R10M.1 U100.Y6(DRAM_RESET)
DDR3_WE: JP10M.113(WE_N) U100.AB16(DRAM_SDWE)
DDR3_ZQPAD: R11M.1 U100.AE17(ZQPAD)
SMB_SCL: JP10M.202(SCL)
SMB_SDA: JP10M.200(SDA)
VTT_VCNTL: C54M.1 R13M.2 U10M.6(VCNTL)
NetC55M_1: C55M.1 R15M.2 R16M.2 U10M.1(VIN)

### Layout directives
differential pair: DDR3_CK0_N, DDR3_CK0_P, DDR3_CK1_N, DDR3_CK1_P, DDR3_DQS0_N, DDR3_DQS0_P, DDR3_DQS1_N, DDR3_DQS1_P, DDR3_DQS2_N, DDR3_DQS2_P, DDR3_DQS3_N, DDR3_DQS3_P, DDR3_DQS4_N, DDR3_DQS4_P, DDR3_DQS5_N, DDR3_DQS5_P, DDR3_DQS6_N, DDR3_DQS6_P, DDR3_DQS7_N, DDR3_DQS7_P
net class DDR_D0: DDR3_D0, DDR3_D1, DDR3_D2, DDR3_D3, DDR3_D4, DDR3_D5, DDR3_D6, DDR3_D7, DDR3_DM0
net class DDR_D1: DDR3_D8, DDR3_D9, DDR3_D10, DDR3_D11, DDR3_D12, DDR3_D13, DDR3_D14, DDR3_D15, DDR3_DM1
net class DDR_D2: DDR3_D16, DDR3_D17, DDR3_D18, DDR3_D19, DDR3_D20, DDR3_D21, DDR3_D22, DDR3_D23, DDR3_DM2
net class DDR_D3: DDR3_D24, DDR3_D25, DDR3_D26, DDR3_D27, DDR3_D28, DDR3_D29, DDR3_D30, DDR3_D31, DDR3_DM3
net class DDR_D4: DDR3_D32, DDR3_D33, DDR3_D34, DDR3_D35, DDR3_D36, DDR3_D37, DDR3_D38, DDR3_D39, DDR3_DM4
net class DDR_D5: DDR3_D40, DDR3_D41, DDR3_D42, DDR3_D43, DDR3_D44, DDR3_D45, DDR3_D46, DDR3_D47, DDR3_DM5
net class DDR_D6: DDR3_D48, DDR3_D49, DDR3_D50, DDR3_D51, DDR3_D52, DDR3_D53, DDR3_D54, DDR3_D55, DDR3_DM6
net class DDR_D7: DDR3_D56, DDR3_D57, DDR3_D58, DDR3_D59, DDR3_D60, DDR3_D61, DDR3_D62, DDR3_D63, DDR3_DM7
net class DDR_CTL: DDR3_A0, DDR3_A1, DDR3_A2, DDR3_A3, DDR3_A4, DDR3_A5, DDR3_A6, DDR3_A7, DDR3_A8, DDR3_A9, DDR3_A10, DDR3_A11, DDR3_A12, DDR3_A13, DDR3_A14, DDR3_A15, DDR3_BA0, DDR3_BA1, DDR3_BA2, DDR3_CAS, DDR3_CKE0, DDR3_CKE1, DDR3_CS0, DDR3_CS1, DDR3_ODT0, DDR3_ODT1, DDR3_RAS, DDR3_RESET, DDR3_WE
net class DDR_CLK0: DDR3_CK0_N, DDR3_CK0_P
net class DDR_CLK1: DDR3_CK1_N, DDR3_CK1_P

### Notes on the sheet
- address 0xA0
- Option: SW4 power supply instead of SW3 to reduce VTT power:
- (near C40M) SW4 is unused, so reprogram in BSP to 1.1V
- (near C40M) (Approx 0.3-0.4V min drop-out @ 0.5A, 100C))
- Copyright 2014 Andrew "bunnie" Huang
- Copyrights: CC-BY-SA 3.0
- Patents: Apache 2.0
- Novena PVT2-A
- (in symbol PCIMX6Q6VV1A, part J) i.MX6Q - DDR

### Library data of the parts
C10M C12M C13M C14M C16M C18M C20M C24M C25M C26M C27M C40M C41M C42M C43M C44M C45M C46M C47M C48M C49M C50M C51M C52M C53M C54M C55M C56M = Cap Semi: Capacitor (Semiconductor SIM Model); Published: 8-Jun-2000; LatestRevisionDate: 17-Jul-2002; LatestRevisionNote: Re-released for DXP Platform.; PackageReference: C1206; Publisher: Altium Limited
C11M C15M C17M C19M C21M C22M C23M C28M C29M C30M C31M C32M C33M C34M C35M C36M C37M C38M C39M = Cap Semi: CAP CER 0.22UF 6.3V 20% X5R 0201; Published: 8-Jun-2000; LatestRevisionDate: 17-Jul-2002; LatestRevisionNote: Re-released for DXP Platform.; PackageReference: C1206; Publisher: Altium Limited
JP10M = DDR3_SODIMM: TE Connectivity 2013311 or equiv (9.2mm height)
R10M R11M R12M R13M R14M R15M R16M = Res1: Resistor; Value: 100k; Published: 8-Jun-2000; LatestRevisionDate: 17-Jul-2002; LatestRevisionNote: Re-released for DXP Platform.; PackageReference: AXIAL-0.3; Publisher: Altium Limited
U10M = RT9045GSP: 1.8A sink/source bus termination regulator (VTT)
U100 = PCIMX6Q6VV1A: PCIMX6Q5EVT10AC; PRE_APN: 344-01218; MFG_NAME01: Freescale Semiconductor; AGILE_PN: TMP-WF-14526; HARD_LOCATION: TRUE; HEIGHT: 2.16MM; ROHS: Yes; MFG_PN01: PCIMX6Q6VV1A

## Sheet 04pwr_pmic.SchDoc
size B
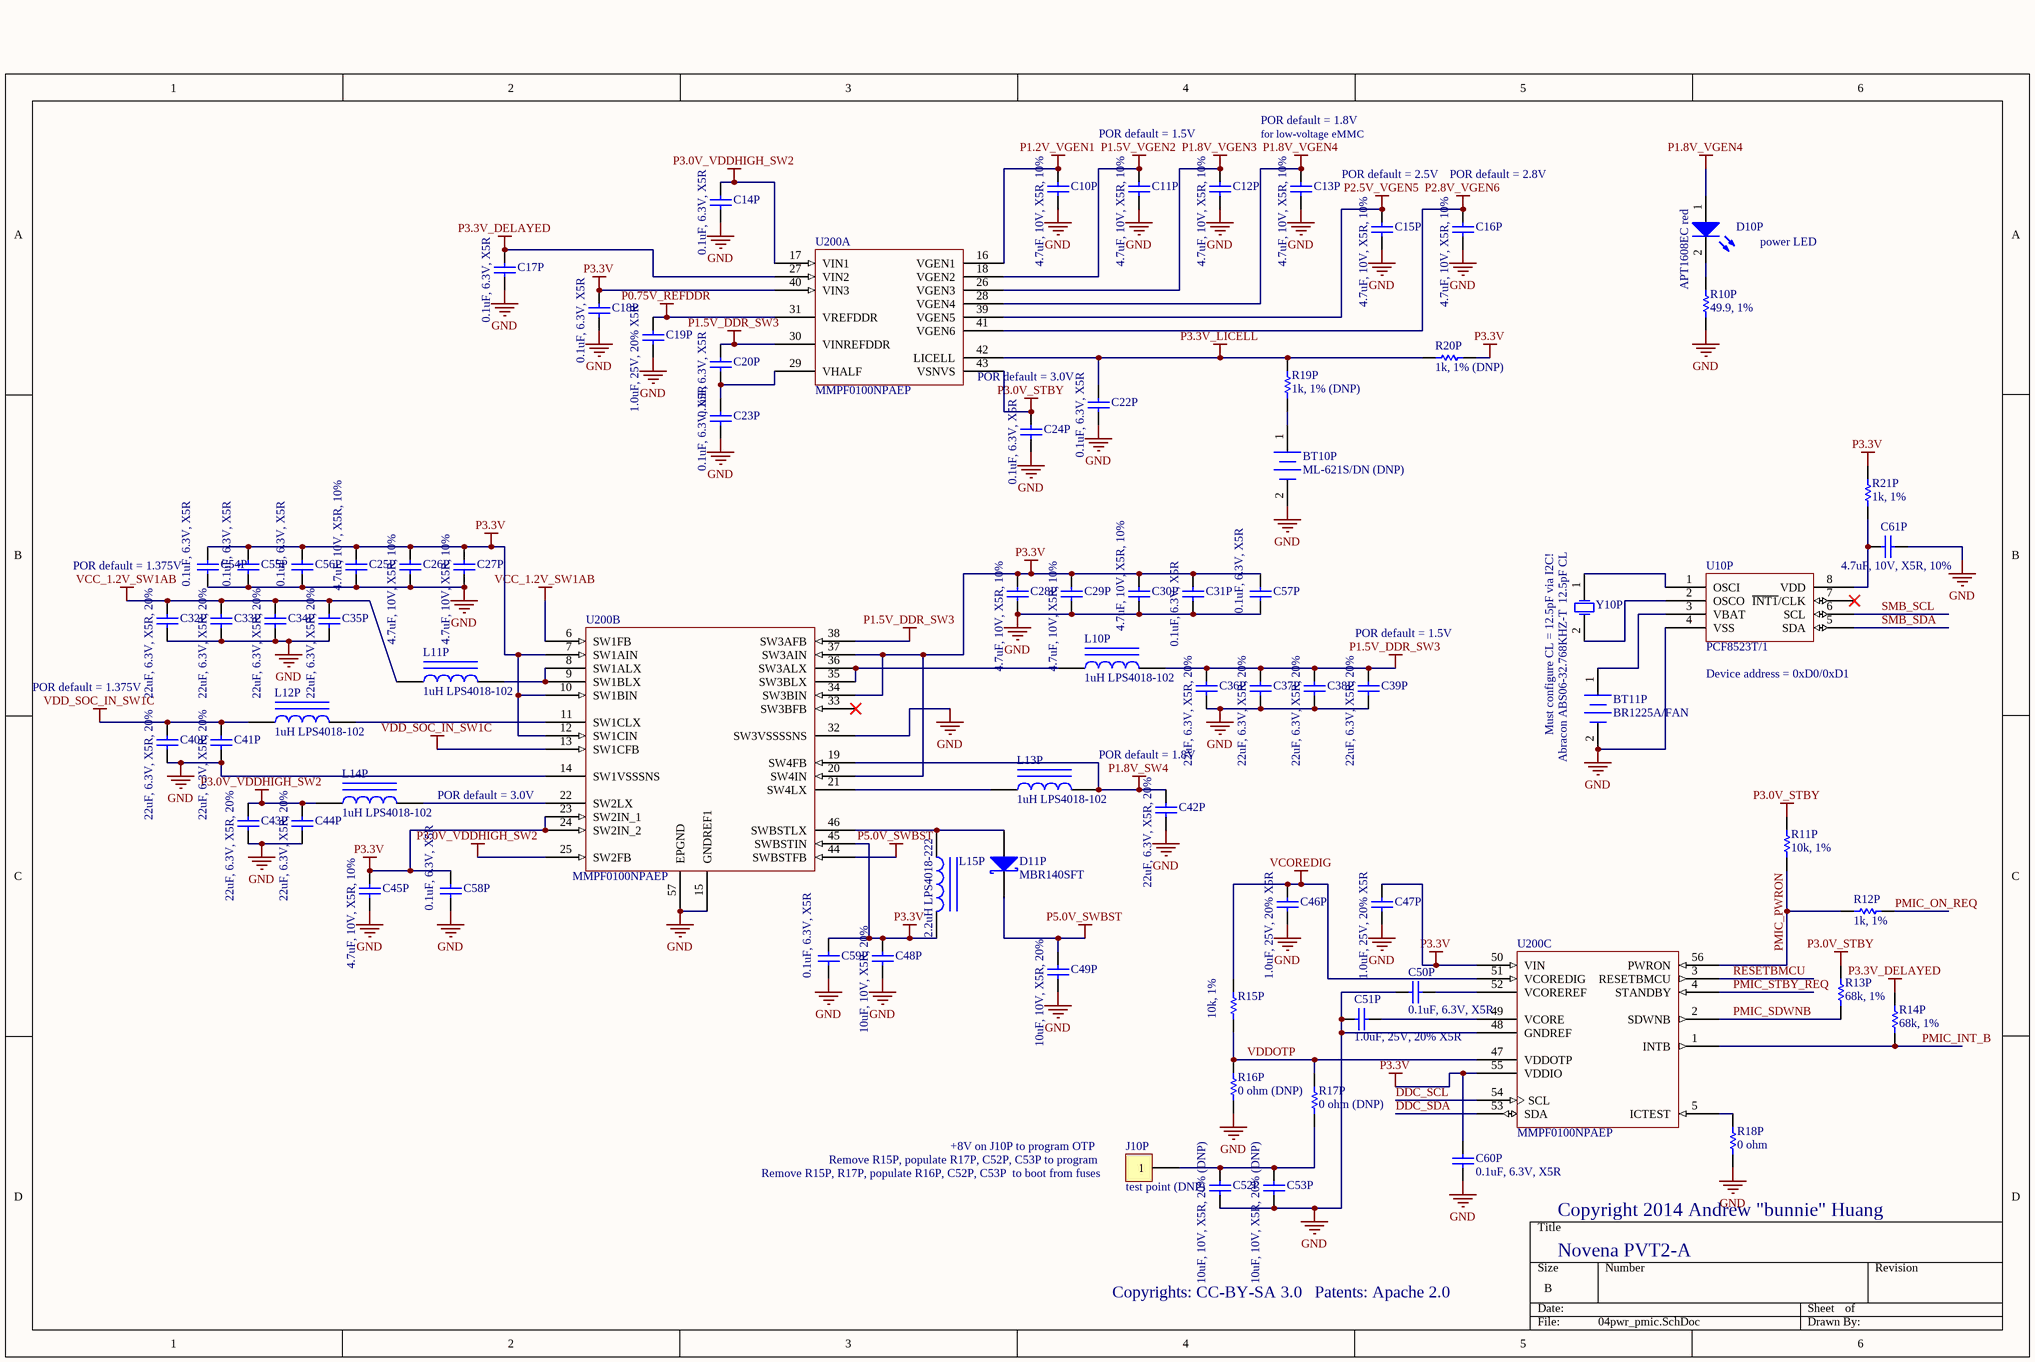
[diagram p3: 04pwr_pmic.SchDoc]

### Parts
BT10P  ML-621S/DN (DNP)  [PAN_ML-621S-DN]
BT11P  BR1225A/FAN  [BR1225A/FA]
C10P  4.7uF, 10V, X5R, 10%  [CAPC1608N_HD]
C11P  4.7uF, 10V, X5R, 10%  [CAPC1608N_HD]
C12P  4.7uF, 10V, X5R, 10%  [CAPC1608N_HD]
C13P  4.7uF, 10V, X5R, 10%  [CAPC1608N_HD]
C14P  0.1uF, 6.3V, X5R  [CAPC0603N_B]
C15P  4.7uF, 10V, X5R, 10%  [CAPC1608N_HD]
C16P  4.7uF, 10V, X5R, 10%  [CAPC1608N_HD]
C17P  0.1uF, 6.3V, X5R  [CAPC0603N_B]
C18P  0.1uF, 6.3V, X5R  [CAPC0603N_B]
C19P  1.0uF, 25V, 20% X5R  [CAPC1608N_HD]
C20P  0.1uF, 6.3V, X5R  [CAPC0603N_B]
C22P  0.1uF, 6.3V, X5R  [CAPC0603N_B]
C23P  0.1uF, 6.3V, X5R  [CAPC0603N_B]
C24P  0.1uF, 6.3V, X5R  [CAPC0603N_B]
C25P  4.7uF, 10V, X5R, 10%  [CAPC1608N_HD]
C26P  4.7uF, 10V, X5R, 10%  [CAPC1608N_HD]
C27P  4.7uF, 10V, X5R, 10%  [CAPC1608N_HD]
C28P  4.7uF, 10V, X5R, 10%  [CAPC1608N_HD]
C29P  4.7uF, 10V, X5R, 10%  [CAPC1608N_HD]
C30P  4.7uF, 10V, X5R, 10%  [CAPC1608N_HD]
C31P  0.1uF, 6.3V, X5R  [CAPC0603N_B]
C32P  22uF, 6.3V, X5R, 20%  [CAPC1608N_HD]
C33P  22uF, 6.3V, X5R, 20%  [CAPC1608N_HD]
C34P  22uF, 6.3V, X5R, 20%  [CAPC1608N_HD]
C35P  22uF, 6.3V, X5R, 20%  [CAPC1608N_HD]
C36P  22uF, 6.3V, X5R, 20%  [CAPC1608N_HD]
C37P  22uF, 6.3V, X5R, 20%  [CAPC1608N_HD]
C38P  22uF, 6.3V, X5R, 20%  [CAPC1608N_HD]
C39P  22uF, 6.3V, X5R, 20%  [CAPC1608N_HD]
C40P  22uF, 6.3V, X5R, 20%  [CAPC1608N_HD]
C41P  22uF, 6.3V, X5R, 20%  [CAPC1608N_HD]
C42P  22uF, 6.3V, X5R, 20%  [CAPC1608N_HD]
C43P  22uF, 6.3V, X5R, 20%  [CAPC1608N_HD]
C44P  22uF, 6.3V, X5R, 20%  [CAPC1608N_HD]
C45P  4.7uF, 10V, X5R, 10%  [CAPC1608N_HD]
C46P  1.0uF, 25V, 20% X5R  [CAPC1608N_HD]
C47P  1.0uF, 25V, 20% X5R  [CAPC1608N_HD]
C48P  10uF, 10V, X5R, 20%  [CAPC1608N]
C49P  10uF, 10V, X5R, 20%  [CAPC1608N]
C50P  0.1uF, 6.3V, X5R  [CAPC0603N_B]
C51P  1.0uF, 25V, 20% X5R  [CAPC1608N_HD]
C52P  10uF, 10V, X5R, 20% (DNP)  [CAPC1608N]
C53P  10uF, 10V, X5R, 20% (DNP)  [CAPC1608N]
C54P  0.1uF, 6.3V, X5R  [CAPC0603N_B]
C55P  0.1uF, 6.3V, X5R  [CAPC0603N_B]
C56P  0.1uF, 6.3V, X5R  [CAPC0603N_B]
C57P  0.1uF, 6.3V, X5R  [CAPC0603N_B]
C58P  0.1uF, 6.3V, X5R  [CAPC0603N_B]
C59P  0.1uF, 6.3V, X5R  [CAPC0603N_B]
C60P  0.1uF, 6.3V, X5R  [CAPC0603N_B]
C61P  4.7uF, 10V, X5R, 10%  [CAPC1608N_HD]
D10P  APT1608EC red  [CD1608-0603]
D11P  MBR140SFT  [SOD123]
J10P  test point (DNP)  [TP_SMT_38mil]
L10P  1uH LPS4018-102  [COILCRAFT_LPS4018]
L11P  1uH LPS4018-102  [COILCRAFT_LPS4018]
L12P  1uH LPS4018-102  [COILCRAFT_LPS4018]
L13P  1uH LPS4018-102  [COILCRAFT_LPS4018]
L14P  1uH LPS4018-102  [COILCRAFT_LPS4018]
L15P  2.2uH LPS4018-222  [COILCRAFT_LPS4018]
R10P  49.9, 1%  [RESC1005N]
R11P  10k, 1%  [RESC1005N]
R12P  1k, 1%  [RESC1005N]
R13P  68k, 1%  [RESC1005N]
R14P  68k, 1%  [RESC1005N]
R15P  10k, 1%  [RESC1005N]
R16P  0 ohm (DNP)  [RESC1005N]
R17P  0 ohm (DNP)  [RESC1005N]
R18P  0 ohm  [RESC1005N]
R19P  1k, 1% (DNP)  [RESC1005N]
R20P  1k, 1% (DNP)  [RESC1005N]
R21P  1k, 1%  [RESC1005N]
U10P  PCF8523T/1  [SOIC127P600-8N]
U200  MMPF0100NPAEP  [FREESCALE_QFN50P800X800X90-56N]  (parts A,B,C of 3)
Y10P  Abracon ABS06-32.768KHZ-T  12.5pF CL  [ABS06]

### Nets
GND: BT10P.2(-) BT11P.2(-) C10P.2 C11P.2 C12P.2 C13P.2 C14P.2 C15P.2 C16P.2 C17P.2 C18P.2 C19P.2 C22P.2 C23P.2 C24P.2 C25P.2 C26P.2 C27P.2 C28P.2 C29P.2 C30P.2 C31P.2 C32P.2 C33P.2 C34P.2 C35P.2 C36P.2 C37P.2 C38P.2 C39P.2 C40P.2 C41P.2 C42P.2 C43P.2 C44P.2 C45P.2 C46P.2 C47P.2 C48P.2 C49P.2 C50P.2 C51P.2 C52P.2 C53P.2 C54P.2 C55P.2 C56P.2 C57P.2 C58P.2 C59P.2 C60P.1 C61P.2 R10P.1 R16P.1 R18P.1 U10P.4(VSS) U200.14(SW1VSSSNS) U200.15(GNDREF1) U200.32(SW3VSSSSNS) U200.48(GNDREF) U200.57(EPGND)
P0.75V_REFDDR: C19P.1 U200.31(VREFDDR)
P1.2V_VGEN1: C10P.1 U200.16(VGEN1)
P1.5V_DDR_SW3: C20P.1 C36P.1 C37P.1 C38P.1 C39P.1 L10P.2 U200.30(VINREFDDR) U200.38(SW3AFB)
P1.5V_VGEN2: C11P.1 U200.18(VGEN2)
P1.8V_SW4: C42P.1 L13P.2 U200.19(SW4FB)
P1.8V_VGEN3: C12P.1 U200.26(VGEN3)
P1.8V_VGEN4: C13P.1 D10P.1(A) U200.28(VGEN4)
P2.5V_VGEN5: C15P.1 U200.39(VGEN5)
P2.8V_VGEN6: C16P.1 U200.41(VGEN6)
P3.0V_STBY: C24P.1 R11P.2 R13P.2 U200.43(VSNVS)
P3.0V_VDDHIGH_SW2: C14P.1 C43P.1 C44P.1 L14P.1 U200.17(VIN1) U200.25(SW2FB)
P3.3V: C18P.1 C25P.1 C26P.1 C27P.1 C28P.1 C29P.1 C30P.1 C31P.1 C45P.1 C47P.1 C48P.1 C54P.1 C55P.1 C56P.1 C57P.1 C58P.1 C59P.1 C60P.2 L15P.2 R20P.2 R21P.2 U200.7(SW1AIN) U200.10(SW1BIN) U200.12(SW1CIN) U200.20(SW4IN) U200.23(SW2IN_1) U200.24(SW2IN_2) U200.34(SW3BIN) U200.37(SW3AIN) U200.40(VIN3) U200.45(SWBSTIN) U200.50(VIN) U200.55(VDDIO)
P3.3V_DELAYED: C17P.1 R14P.2 U200.27(VIN2)
P3.3V_LICELL: C22P.1 R19P.2 R20P.1 U200.42(LICELL)
P5.0V_SWBST: C49P.1 D11P.2(K) U200.44(SWBSTFB)
VCC_1.2V_SW1AB: C32P.1 C33P.1 C34P.1 C35P.1 L11P.1 U200.6(SW1FB)
VCOREDIG: C46P.1 R15P.2 U200.51(VCOREDIG)
VDD_SOC_IN_SW1C: C40P.1 C41P.1 L12P.1 U200.13(SW1CFB)
DDC_SCL: U200.54(SCL)
DDC_SDA: U200.53(SDA)
PMIC_INT_B: R14P.1 U200.1(INTB)
PMIC_ON_REQ: R12P.2
PMIC_PWRON: R11P.1 R12P.1 U200.56(PWRON)
PMIC_SDWNB: R13P.1 U200.2(SDWNB)
PMIC_STBY_REQ: U200.4(STANDBY)
RESETBMCU: U200.3(RESETBMCU)
SMB_SCL: U10P.6(SCL)
SMB_SDA: U10P.5(SDA)
VDDOTP: R15P.1 R16P.2 R17P.2 U200.47(VDDOTP)
NetBT10P_1: BT10P.1(+) R19P.1
NetBT11P_1: BT11P.1(+) U10P.3(VBAT)
NetC20P_2: C20P.2 C23P.1 U200.29(VHALF)
NetC50P_1: C50P.1 U200.52(VCOREREF)
NetC51P_1: C51P.1 U200.49(VCORE)
NetC52P_1: C52P.1 C53P.1 J10P.1 R17P.1
NetC61P_1: C61P.1 R21P.1 U10P.8(VDD)
NetD10P_2: D10P.2(K) R10P.2
NetD11P_1: D11P.1(A) L15P.1 U200.46(SWBSTLX)
NetL10P_1: L10P.1 U200.35(SW3BLX) U200.36(SW3ALX)
NetL11P_2: L11P.2 U200.8(SW1ALX) U200.9(SW1BLX)
NetL12P_2: L12P.2 U200.11(SW1CLX)
NetL13P_1: L13P.1 U200.21(SW4LX)
NetL14P_2: L14P.2 U200.22(SW2LX)
NetR18P_2: R18P.2 U200.5(ICTEST)
NetU10P_1: U10P.1(OSCI) Y10P.1(OSC1)
NetU10P_2: U10P.2(OSCO) Y10P.2(OSC2)

Not connected (* = marked no-connect by the designer): U10P 7(~{INT1}/CLK)*; U200 33(SW3BFB)*

### Notes on the sheet
- POR default = 1.5V
- for low-voltage eMMC
- POR default = 1.8V
- POR default = 2.5V
- (near C16P) POR default = 2.8V
- power LED
- POR default = 3.0V
- (near C54P) POR default = 1.375V
- POR default = 1.375V
- (near U10P) Device address = 0xD0/0xD1
- Must configure CL = 12.5pF via I2C!
- (near J10P) Remove R15P, R17P, populate R16P, C52P, C53P  to boot from fuses
- (near J10P) Remove R15P, populate R17P, C52P, C53P to program
- (near J10P) +8V on J10P to program OTP
- (near R18P) Copyright 2014 Andrew "bunnie" Huang
- Copyrights: CC-BY-SA 3.0
- Patents: Apache 2.0
- Novena PVT2-A

### Library data of the parts
BT10P BT11P = Battery: Panasonic Manganese Lithium Rechargeable battery; Published: 24-Mar-1999; LatestRevisionDate: 17-Jul-2002; LatestRevisionNote: Re-released for DXP Platform.; PackageReference: BAT-2; Publisher: Altium Limited; PackageDescription: Battery; 2 Leads
C10P C11P C12P C13P C14P C15P C16P C17P C18P C19P C20P C22P C23P C24P C25P C26P C27P C28P C29P C30P C31P C32P C33P C34P C35P C36P C37P C38P C39P C40P C41P C42P C43P C44P C45P C46P C47P C48P C49P C50P C51P C52P C53P C54P C55P C56P C57P C58P C59P C60P C61P = Cap Semi: Capacitor (Semiconductor SIM Model); Published: 8-Jun-2000; LatestRevisionDate: 17-Jul-2002; LatestRevisionNote: Re-released for DXP Platform.; PackageReference: C1206; Publisher: Altium Limited
D10P = LED2: Typical RED, GREEN, YELLOW, AMBER GaAs LED; Published: 8-Jun-2000; LatestRevisionDate: 17-Jul-2002; LatestRevisionNote: Re-released for DXP Platform.; PackageVersion: Feb-2002; PackageReference: 3.2X1.6X1.1; Publisher: Altium Limited
D11P = D Schottky: Schottky Diode; Code - JEDEC: DO-214-AA; Published: 8-Jun-2000; Publisher: Altium Limited; Revision: July-2002: Re-released for DXP Platform.
J10P = CON1: Connector
L10P L11P L12P L13P L14P L15P = Inductor Iron: Magnetic-Core Inductor; Published: 24-Mar-1999; LatestRevisionDate: 17-Jul-2002; LatestRevisionNote: Re-released for DXP Platform.; PackageReference: AXIAL-0.9; Publisher: Altium Limited
R10P R11P R12P R13P R14P R15P R16P R17P R18P R19P R20P R21P = Res1: Resistor; Value: 100k; Published: 8-Jun-2000; LatestRevisionDate: 17-Jul-2002; LatestRevisionNote: Re-released for DXP Platform.; PackageReference: AXIAL-0.3; Publisher: Altium Limited
U10P = PCF8523T/1: RTC and calendar chip
U200 = PMPF0100NPEP: PMIC for i.MX6 series
Y10P = XTAL: Crystal Oscillator; Published: 8-Jun-2000; LatestRevisionDate: 17-Jul-2002; LatestRevisionNote: Re-released for DXP Platform.; PackageReference: R38; Publisher: Altium Limited

## Sheet 05pwr_input.SchDoc
size B
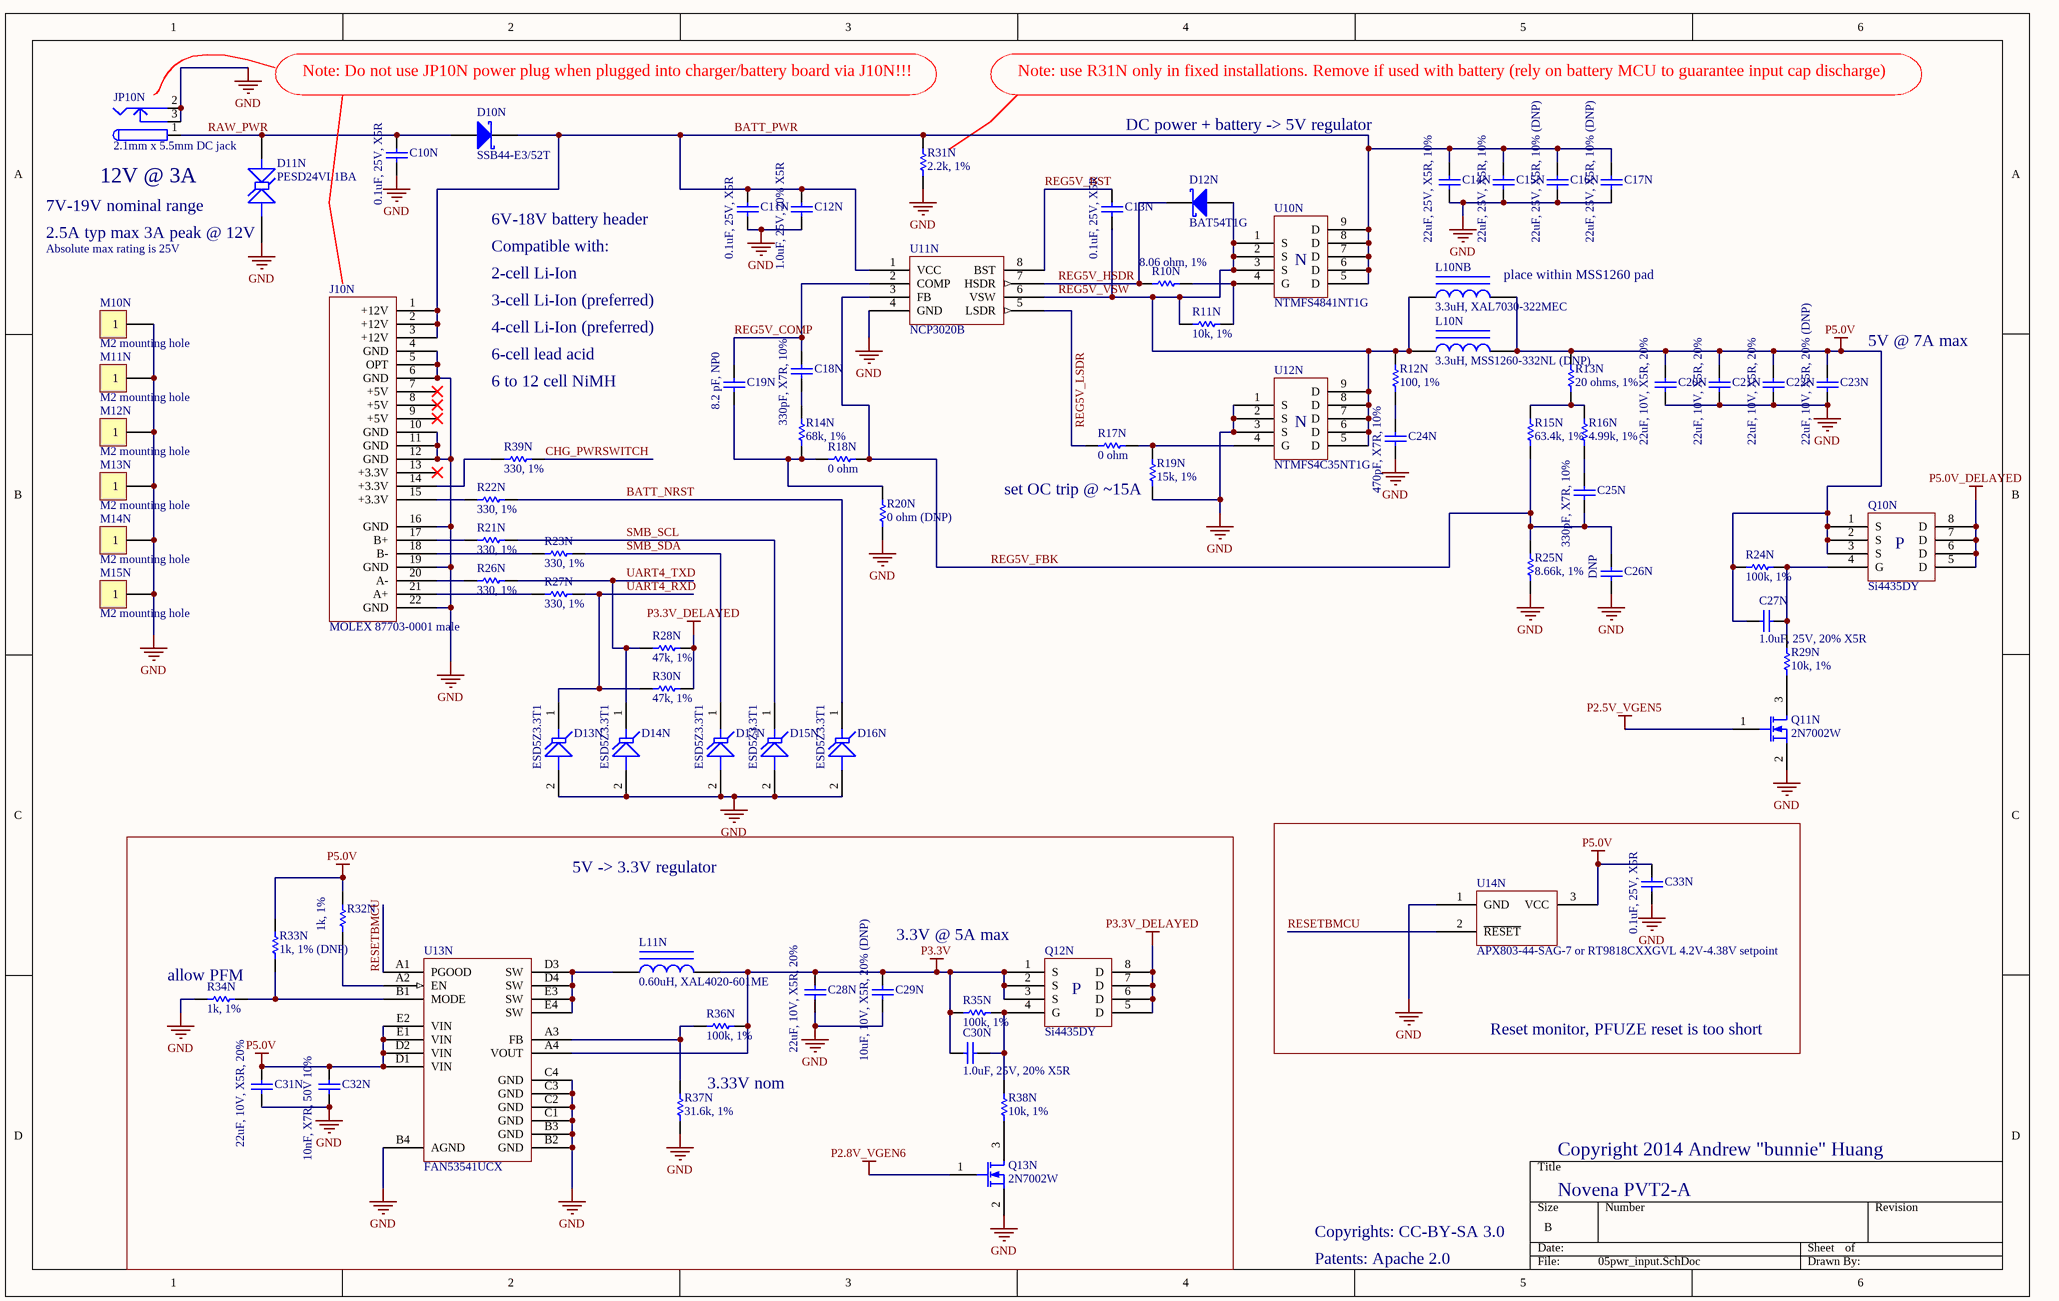
[diagram p4: 05pwr_input.SchDoc]

### Parts
C10N  0.1uF, 25V, X5R  [CAPC1005N]
C11N  0.1uF, 25V, X5R  [CAPC1005N]
C12N  1.0uF, 25V, 20% X5R  [CAPC1608N]
C13N  0.1uF, 25V, X5R  [CAPC1005N]
C14N  22uF, 25V, X5R, 10%  [CAPC3225N]
C15N  22uF, 25V, X5R, 10%  [CAPC3225N]
C16N  22uF, 25V, X5R, 10% (DNP)  [CAPC3225N]
C17N  22uF, 25V, X5R, 10% (DNP)  [CAPC3225N]
C18N  330pF, X7R, 10%  [CAPC1005N]
C19N  8.2 pF, NP0  [CAPC1005N]
C20N  22uF, 10V, X5R, 20%  [CAPC2012N]
C21N  22uF, 10V, X5R, 20%  [CAPC2012N]
C22N  22uF, 10V, X5R, 20%  [CAPC2012N]
C23N  22uF, 10V, X5R, 20% (DNP)  [CAPC2012N]
C24N  470pF, X7R, 10%  [CAPC1005N]
C25N  330pF, X7R, 10%  [CAPC1005N]
C26N  DNP  [CAPC1005N]
C27N  1.0uF, 25V, 20% X5R  [CAPC1608N]
C28N  22uF, 10V, X5R, 20%  [CAPC2012N]
C29N  10uF, 10V, X5R, 20% (DNP)  [CAPC1608N]
C30N  1.0uF, 25V, 20% X5R  [CAPC1608N]
C31N  22uF, 10V, X5R, 20%  [CAPC2012N]
C32N  10nF, X7R, 50V 10%  [CAPC1005N]
C33N  0.1uF, 25V, X5R  [CAPC1005N]
D10N  SSB44-E3/52T  [DSO-C2/X2.3]
D11N  PESD24VL1BA  [SOD-323]
D12N  BAT54T1G  [SOD123]
D13N  ESD5Z3.3T1  [SOD-523]
D14N  ESD5Z3.3T1  [SOD-523]
D15N  ESD5Z3.3T1  [SOD-523]
D16N  ESD5Z3.3T1  [SOD-523]
D17N  ESD5Z3.3T1  [SOD-523]
J10N  MOLEX 87703-0001 male  [SATA_MOLEX-87703-0001]
JP10N  2.1mm x 5.5mm DC jack  [CUI_PJ_002AH_SMT]
L10N  3.3uH, MSS1260-332NL (DNP)  [COILCRAFT_MSS1048]
L10NB  3.3uH, XAL7030-322MEC  [COILCRAFT_XAL7030]
L11N  0.60uH, XAL4020-601ME  [COILCRAFT_XAL4020]
M10N  M2 mounting hole  [HOLE_M2_MOUNT]
M11N  M2 mounting hole  [HOLE_M2_MOUNT]
M12N  M2 mounting hole  [HOLE_M2_MOUNT]
M13N  M2 mounting hole  [HOLE_M2_MOUNT]
M14N  M2 mounting hole  [HOLE_M2_MOUNT]
M15N  M2 mounting hole  [HOLE_M2_MOUNT]
Q10N  Si4435DY  [SOIC127P600-8AN]
Q11N  2N7002W  [SOT323-3AN]
Q12N  Si4435DY  [SOIC127P600-8AN]
Q13N  2N7002W  [SOT323-3AN]
R10N  8.06 ohm, 1%  [RESC1005N]
R11N  10k, 1%  [RESC1005N]
R12N  100, 1%  [RESC1005N]
R13N  20 ohms, 1%  [RESC1005N]
R14N  68k, 1%  [RESC1005N]
R15N  63.4k, 1%  [RESC1005N]
R16N  4.99k, 1%  [RESC1005N]
R17N  0 ohm  [RESC1005N]
R18N  0 ohm  [RESC1005N]
R19N  15k, 1%  [RESC1005N]
R20N  0 ohm (DNP)  [RESC1005N]
R21N  330, 1%  [RESC1005N]
R22N  330, 1%  [RESC1005N]
R23N  330, 1%  [RESC1005N]
R24N  100k, 1%  [RESC1005N]
R25N  8.66k, 1%  [RESC1005N]
R26N  330, 1%  [RESC1005N]
R27N  330, 1%  [RESC1005N]
R28N  47k, 1%  [RESC1005N]
R29N  10k, 1%  [RESC1005N]
R30N  47k, 1%  [RESC1005N]
R31N  2.2k, 1%  [RESC1005N]
R32N  1k, 1%  [RESC1005N]
R33N  1k, 1% (DNP)  [RESC1005N]
R34N  1k, 1%  [RESC1005N]
R35N  100k, 1%  [RESC1005N]
R36N  100k, 1%  [RESC1005N]
R37N  31.6k, 1%  [RESC1005N]
R38N  10k, 1%  [RESC1005N]
R39N  330, 1%  [RESC1005N]
U10N  NTMFS4841NT1G  [ONSEMI_DFN5_5x6_1.27P]
U11N  NCP3020B  [SOIC127P600-8AN]
U12N  NTMFS4C35NT1G  [ONSEMI_DFN5_5x6_1.27P]
U13N  FAN53541UCX  [FAIRCHILD_WLCSP_BGA100P9X9-81A]
U14N  APX803-44-SAG-7 or RT9818CXXGVL 4.2V-4.38V setpoint  [SOT23-3N]

### Blocks framed on the sheet
Reset monitor, PFUZE reset is too short: C33N U14N

### Nets
GND: C10N.2 C11N.2 C12N.2 C14N.2 C15N.2 C16N.2 C17N.2 C20N.2 C21N.2 C22N.2 C23N.2 C24N.2 C26N.2 C28N.2 C29N.2 C31N.2 C32N.2 C33N.2 D11N.1(A) D13N.2(A) D14N.2(A) D15N.2(A) D16N.2(A) D17N.2(A) J10N.4(GND) J10N.5(OPT) J10N.6(GND) J10N.10(GND) J10N.11(GND) J10N.12(GND) J10N.16(GND) J10N.19(GND) J10N.22(GND) JP10N.2 JP10N.3 M10N.1 M11N.1 M12N.1 M13N.1 M14N.1 M15N.1 Q11N.2(S) Q13N.2(S) R19N.1 R20N.1 R25N.1 R31N.1 R34N.2 R37N.1 U11N.4(GND) U12N.1(S) U12N.2(S) U12N.3(S) U13N.B2(GND) U13N.B3(GND) U13N.B4(AGND) U13N.C1(GND) U13N.C2(GND) U13N.C3(GND) U13N.C4(GND) U14N.1(GND)
P2.5V_VGEN5: Q11N.1(G)
P2.8V_VGEN6: Q13N.1(G)
P3.3V: C28N.1 C29N.1 C30N.1 L11N.2 Q12N.1(S) Q12N.2(S) Q12N.3(S) R35N.2 R36N.1 U13N.A4(VOUT)
P3.3V_DELAYED: Q12N.5(D) Q12N.6(D) Q12N.7(D) Q12N.8(D) R28N.1 R30N.1
P5.0V: C20N.1 C21N.1 C22N.1 C23N.1 C27N.1 C31N.1 C32N.1 C33N.1 L10N.2 L10NB.2 Q10N.1(S) Q10N.2(S) Q10N.3(S) R13N.2 R24N.2 R32N.1 R33N.2 U13N.D1(VIN) U13N.D2(VIN) U13N.E1(VIN) U13N.E2(VIN) U14N.3(VCC)
P5.0V_DELAYED: Q10N.5(D) Q10N.6(D) Q10N.7(D) Q10N.8(D)
BATT_NRST: D16N.1(K) R22N.2
BATT_PWR: C11N.1 C12N.1 C14N.1 C15N.1 C16N.1 C17N.1 D10N.2(K) J10N.1(+12V) J10N.2(+12V) J10N.3(+12V) R31N.2 U10N.5(D) U10N.6(D) U10N.7(D) U10N.8(D) U10N.9(D) U11N.1(VCC)
CHG_PWRSWITCH: R39N.2
RAW_PWR: C10N.1 D10N.1(A) D11N.2(K) JP10N.1
REG5V_BST: C13N.1 U11N.8(BST)
REG5V_COMP: C18N.1 C19N.1 U11N.2(COMP)
REG5V_FBK: C25N.2 C26N.1 R15N.1 R18N.2 R25N.2 U11N.3(FB)
REG5V_HSDR: D12N.2(K) R10N.1 U11N.7(HSDR)
REG5V_LSDR: R17N.1 U11N.5(LSDR)
REG5V_VSW: C13N.2 D12N.1(A) L10N.1 L10NB.1 R11N.2 R12N.2 U10N.1(S) U10N.2(S) U10N.3(S) U11N.6(VSW) U12N.5(D) U12N.6(D) U12N.7(D) U12N.8(D) U12N.9(D)
RESETBMCU: U13N.A1(PGOOD) U14N.2(~{RESET})
SMB_SCL: D15N.1(K) R21N.1
SMB_SDA: D17N.1(K) R23N.2
UART4_RXD: D13N.1(K) R27N.2 R30N.2
UART4_TXD: D14N.1(K) R26N.2 R28N.2
NetC18N_2: C18N.2 R14N.2
NetC19N_2: C19N.2 R14N.1 R18N.1 R20N.2
NetC24N_1: C24N.1 R12N.1
NetC25N_1: C25N.1 R16N.1
NetC27N_2: C27N.2 Q10N.4(G) R24N.1 R29N.1
NetC30N_2: C30N.2 Q12N.4(G) R35N.1 R38N.1
NetJ10N_14: J10N.14(+3.3V) R39N.1
NetJ10N_15: J10N.15(+3.3V) R22N.1
NetJ10N_17: J10N.17(B+) R21N.2
NetJ10N_18: J10N.18(B-) R23N.1
NetJ10N_20: J10N.20(A-) R26N.1
NetJ10N_21: J10N.21(A+) R27N.1
NetL11N_1: L11N.1 U13N.D3(SW) U13N.D4(SW) U13N.E3(SW) U13N.E4(SW)
NetQ11N_3: Q11N.3(D) R29N.2
NetQ13N_3: Q13N.3(D) R38N.2
NetR10N_2: R10N.2 R11N.1 U10N.4(G)
NetR13N_1: R13N.1 R15N.2 R16N.2
NetR17N_2: R17N.2 R19N.2 U12N.4(G)
NetR32N_2: R32N.2 U13N.A2(EN)
NetR33N_1: R33N.1 R34N.1 U13N.B1(MODE)
NetR36N_2: R36N.2 R37N.2 U13N.A3(FB)

Not connected (* = marked no-connect by the designer): J10N 7(+5V)* 8(+5V)* 9(+5V)* 13(+3.3V)*

### Notes on the sheet
- Note: Do not use JP10N power plug when plugged into charger/battery board via J10N!!!
- Note: use R31N only in fixed installations. Remove if used with battery (rely on battery MCU to guarantee input cap discharge)
- DC power + battery -> 5V regulator
- 7V-19V nominal range
- (near D11N) 2.5A typ max 3A peak @ 12V
- (near JP10N) 12V @ 3A
- 6V-18V battery header
- Absolute max rating is 25V
- Compatible with:
- 2-cell Li-Ion
- 3-cell Li-Ion (preferred)
- (near L10NB) place within MSS1260 pad
- 6-cell lead acid
- (near C19N) 4-cell Li-Ion (preferred)
- (near C23N) 5V @ 7A max
- 6 to 12 cell NiMH
- (near R19N) set OC trip @ ~15A
- 5V -> 3.3V regulator
- (near R34N) allow PFM
- 3.3V @ 5A max
- (near R37N) 3.33V nom
- Copyright 2014 Andrew "bunnie" Huang
- Copyrights: CC-BY-SA 3.0
- Novena PVT2-A
- Patents: Apache 2.0
- (in symbol NTMFS4841N) N
- (in symbol Si4435DY) P

### Library data of the parts
C10N C11N C12N C13N C14N C15N C16N C17N C18N C19N C20N C21N C22N C23N C24N C25N C26N C27N C28N C29N C30N C31N C32N C33N = Cap Semi: Capacitor (Semiconductor SIM Model); Published: 8-Jun-2000; LatestRevisionDate: 17-Jul-2002; LatestRevisionNote: Re-released for DXP Platform.; PackageReference: C1206; Publisher: Altium Limited
D10N D12N = D Schottky: Schottky Diode; Code - JEDEC: DO-214-AA; Published: 8-Jun-2000; Publisher: Altium Limited; Revision: July-2002: Re-released for DXP Platform.
D11N = BIDIR_ESD: Bidirectional zener diode, Vz 17.1V nom
D13N D14N D15N D16N D17N = Tranzorb: On Semi 3.3V standoff TVS diode; Published: 24-Mar-1999; LatestRevisionDate: 17-Jul-2002; LatestRevisionNote: Re-released for DXP Platform.; PackageReference: DO-7; Publisher: Altium Limited
J10N = SATA_22P_HEADER: SATA+Power connector
JP10N = PWR2.5: Low Voltage Power Supply Connector; Published: 17-Dec-2003; Datasheet: Latest Revision: 09-May-2002; Publisher: Altium Limited
L10N L10NB L11N = Inductor Iron: Magnetic-Core Inductor; Published: 24-Mar-1999; LatestRevisionDate: 17-Jul-2002; LatestRevisionNote: Re-released for DXP Platform.; PackageReference: AXIAL-0.9; Publisher: Altium Limited
M10N M11N M12N M13N M14N M15N = CON1: Connector
Q10N Q12N = Si4435DY: Singre P-channel FET, 8A, 30V
Q11N Q13N = MOSFET-N: N-Channel MOSFET; Published: 8-Jun-2000; LatestRevisionDate: 17-Jul-2002; LatestRevisionNote: Re-released for DXP Platform.; PackageVersion: 1995/1996; PackageReference: E3; Publisher: Altium Limited
R10N R11N R12N R13N R14N R15N R16N R17N R18N R19N R20N R21N R22N R23N R25N R26N R27N R28N R29N R30N R31N R32N R33N R34N R37N R38N R39N = Res1: Resistor; Value: 100k; Published: 8-Jun-2000; LatestRevisionDate: 17-Jul-2002; LatestRevisionNote: Re-released for DXP Platform.; PackageReference: AXIAL-0.3; Publisher: Altium Limited
R24N R35N R36N = Res1: Resistor; Published: 8-Jun-2000; LatestRevisionDate: 17-Jul-2002; LatestRevisionNote: Re-released for DXP Platform.; PackageReference: AXIAL-0.3; Publisher: Altium Limited; Value: 100k
U10N U12N = NTMFS4841N: N channel power MOSFET, 30V, 57A SO-8FL
U11N = NCP3020B: Synchronous PWM controller, 4.7-28V in, 0.6V ref
U13N = FAN53540UCX: 2.4MHz 5A Sync buck regulator, integrated FET
U14N = RESET_SOT23: Reset monitor. Voltage specified by XX in P/N. Multiple vendors.